# EasyEDA Pro project FrameworkGPU to MXM V3.3.epro, board PCB6
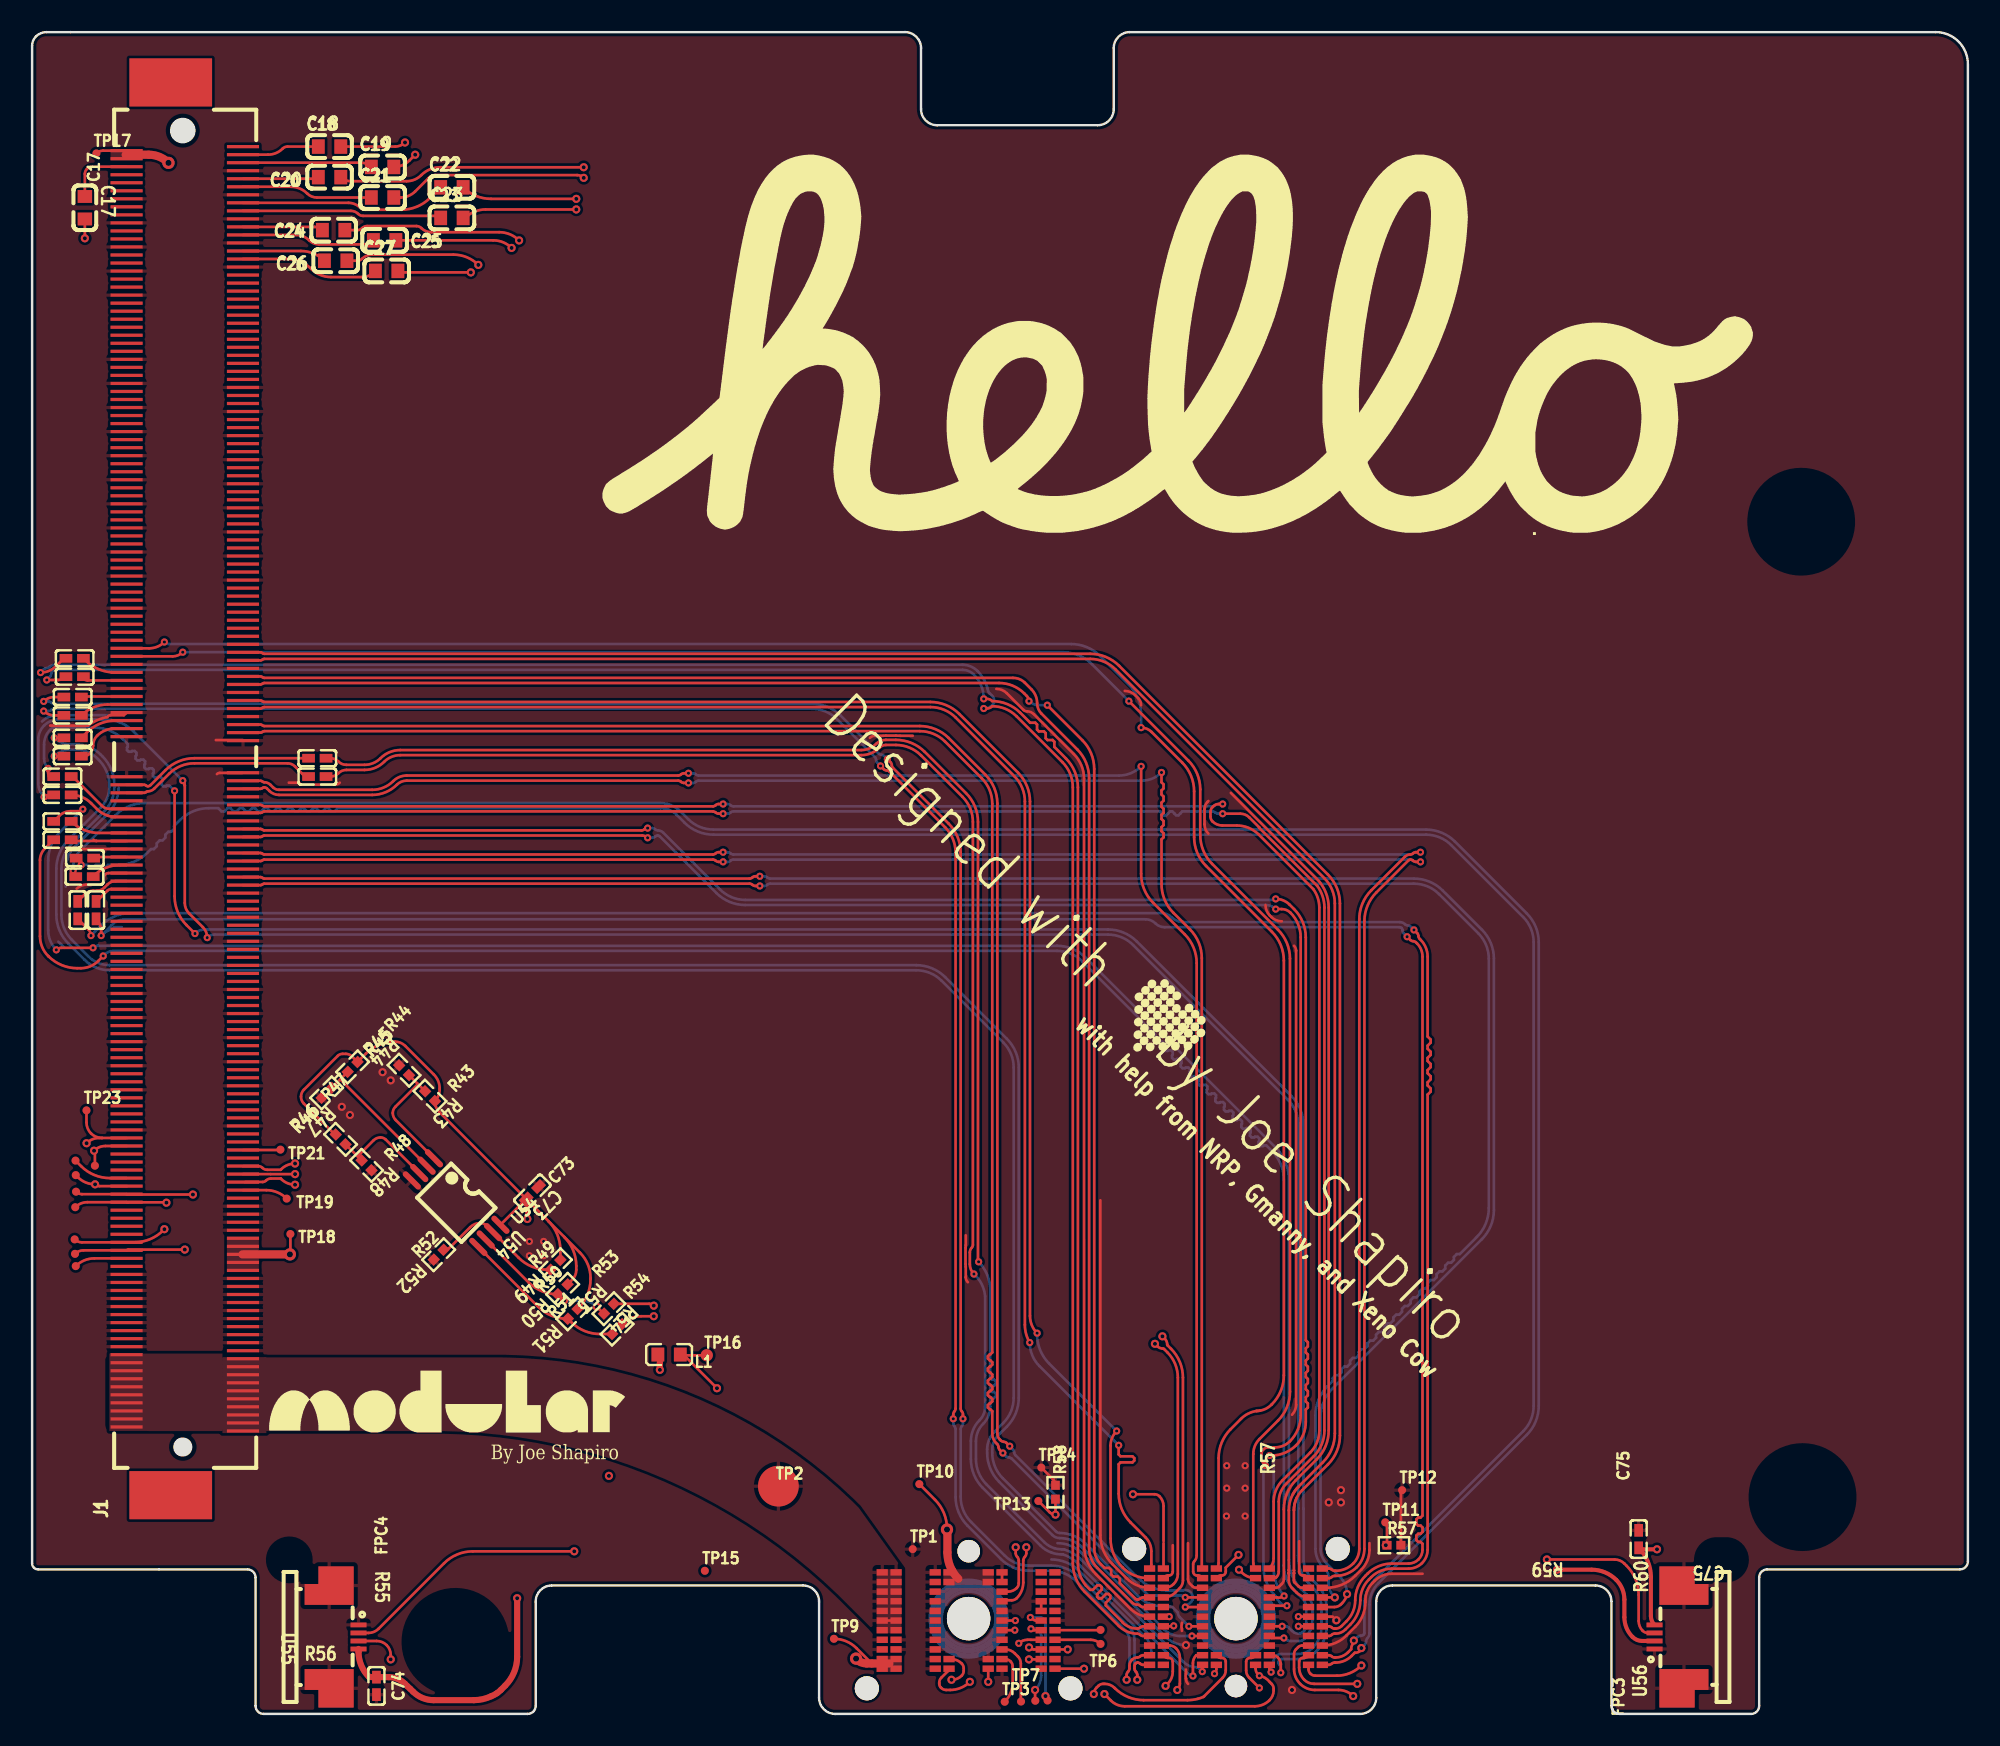
[diagram p7: board, top side]
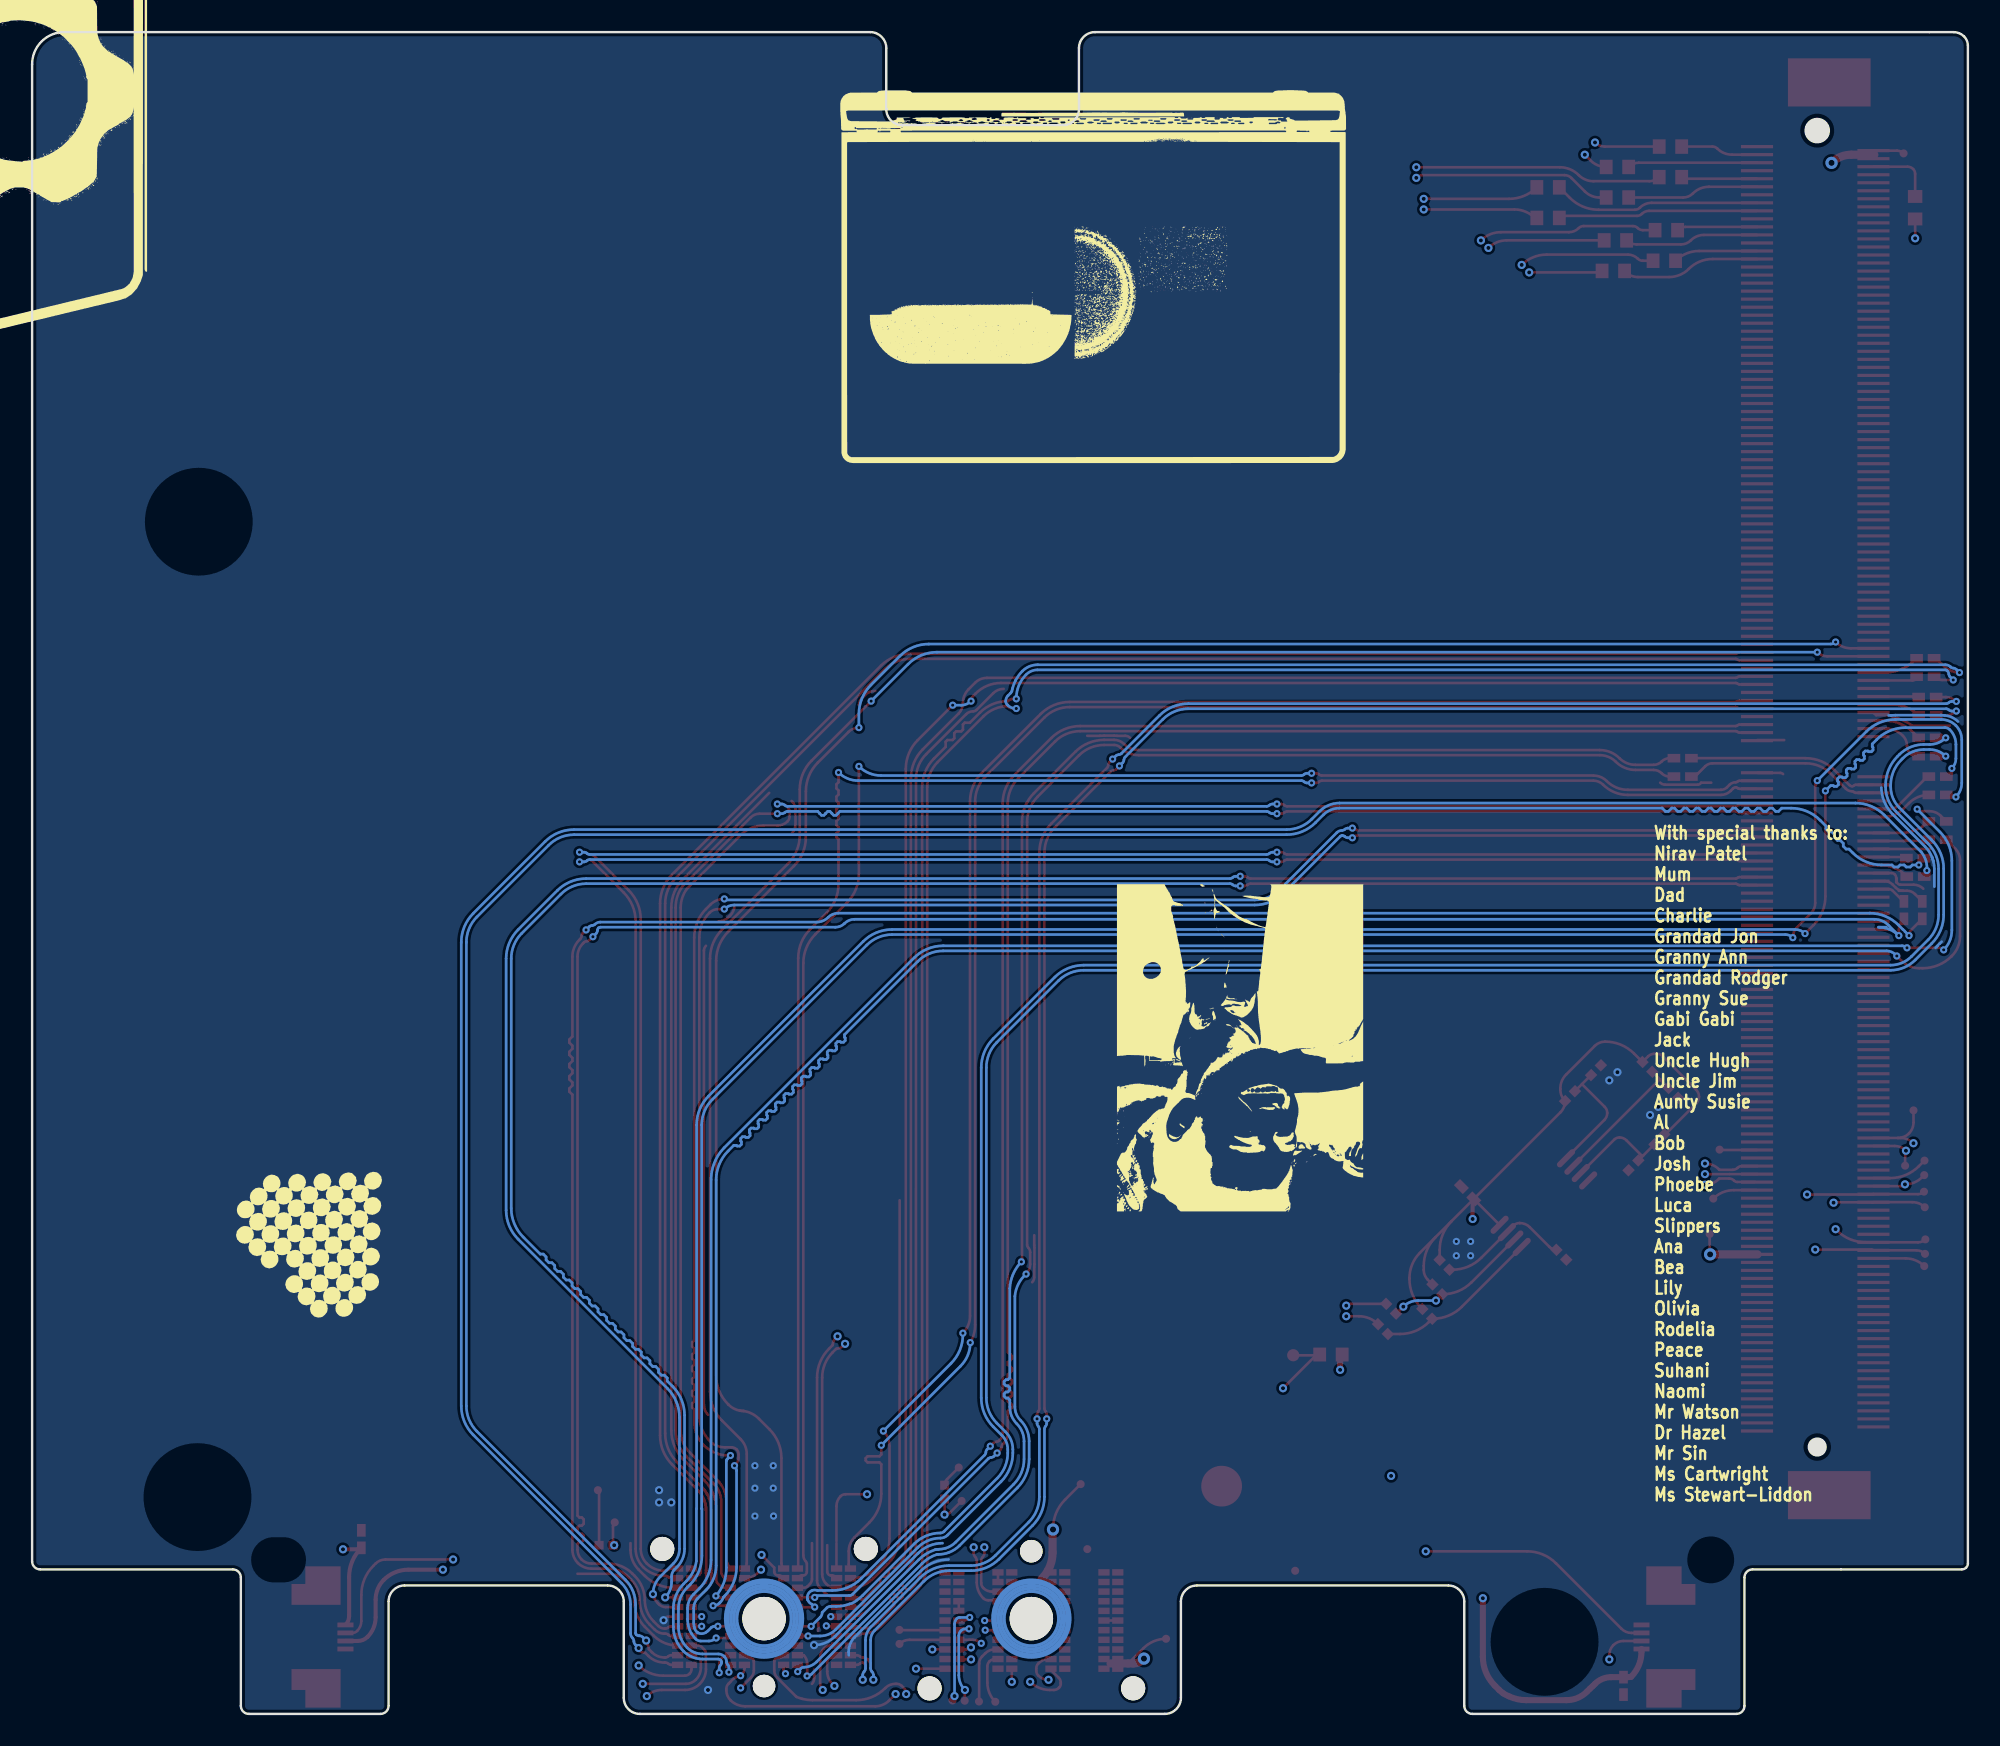
[diagram p8: board, bottom side, seen from below]

Outline 120.56 x 104.76 mm; copper layers: Top Layer, Inner1, Inner2, Inner3, Inner4, Bottom Layer. Coordinates in mm from the lower left corner of the outline.
Outline path: 0,103.91 arc(0.06,104.22) 0.24,104.49 arc(0.54,104.69) 0.89,104.76 54.37,104.76 arc(55.07,104.47) 55.37,103.76 55.37,99.96 arc(55.66,99.25) 56.37,98.96 66.37,98.96 arc(67.07,99.25) 67.37,99.96 67.37,103.76 arc(67.66,104.47) 68.37,104.76 118.56,104.76 arc(119.98,104.17) 120.56,102.76 120.56,9.5 arc(120.42,9.15) 120.06,9 108.06,9 arc(107.71,8.85) 107.56,8.5 107.56,0.5 arc(107.42,0.15) 107.06,0 98.87,0 arc(98.51,0.15) 98.37,0.5 98.37,7 arc(98.07,7.71) 97.37,8 84.72,8 arc(84.01,7.71) 83.72,7 83.72,1 arc(83.42,0.29) 82.72,0 50.02,0 arc(49.31,0.29) 49.02,1 49.02,7 arc(48.72,7.71) 48.02,8 32.37,8 arc(31.66,7.71) 31.37,7 31.37,0.5 arc(31.22,0.15) 30.87,0 14.42,0 arc(14.06,0.15) 13.92,0.5 13.92,8.5 arc(13.77,8.85) 13.42,9 0.38,9 arc(0.23,9.03) 0.11,9.11 arc(0.03,9.23) 0,9.38 0,103.91
Stack: Top Layer 0.035mm Outer layer thickness 1oz / Dielectric1 0.0994mm 3313 RC57% 4.2mil / Inner1 0.0152mm Inner layer thickness / Dielectric2 0.55mm 0.55mm H/H No copper / Inner2 0.0152mm Inner layer thickness / Dielectric3 0.1088mm 2116 RC54% 4.9mil / Inner3 0.0152mm Inner layer thickness / Dielectric4 0.55mm 0.55mm H/H No copper / Inner4 0.0152mm Inner layer thickness / Dielectric5 0.0994mm 3313 RC57% 4.2mil / Bottom Layer 0.035mm Outer layer thickness 1oz

## Design rules (mm)
net PCIE_RX_7N: PCIE_RX_7
net PCIE_RX_1P: PCIE_RX_1, PCIE_RX_1
net PCIE_RX_1N: PCIE_RX_1, PCIE_RX_1
net PCIE_RX_7P: PCIE_RX_7
net PCIE_RX_6N: DP1
net PCIE_RX_3N: PCIE_RX_3
net PCIE_RX_0N: PCIE_RX_0
net PCIE_RX_0P: PCIE_RX_0
net PCIE_RX_4N: PCIE_RX_4
net PCIE_RX_6P: DP1
net PCIE_RX_5N: PCIE_RX_5
net PCIE_RX_5P: PCIE_RX_5
net PCIE_RX_2P: PCIE_RX_2
net PCIE_RX_4P: PCIE_RX_4
net PCIE_RX_3P: PCIE_RX_3
net PCIE_RX_2N: PCIE_RX_2
net PEX_REFCLK-: DP11
net DP_A_AUXN: DP_A_AUX
net PEX_REFCLK+: DP11
net DP_A_AUXP: DP_A_AUX
net DP_A_L0N: DP_A_L0
net DP_A_L1N: DP_A_L1
net DP_A_L3N: DP_A_L3
net DP_A_L0P: DP_A_L0
net DP_A_L2N: DP_A_L2
net DP_A_L2P: DP_A_L2
net DP_A_L1P: DP_A_L1
net DP_A_L3P: DP_A_L3
net PCIE_TX_7P: DP2
net PCIE_TX_6P: PCIE_TX_6
net PCIE_TX_7N: DP2
net PCIE_TX_6N: PCIE_TX_6
net PCIE_TX_4P: PCIE_TX_4
net PCIE_TX_4N: PCIE_TX_4
net PCIE_TX_3P: PCIE_TX_3
net PCIE_TX_5N: PCIE_TX_5
net PCIE_TX_2N: PCIE_TX_2
net PCIE_TX_0P: PCIE_TX_0
net PCIE_TX_5P: PCIE_TX_5
net PCIE_TX_2P: PCIE_TX_2
net PCIE_TX_0N: PCIE_TX_0
net PCIE_TX_1N: PCIE_TX_1, PCIE_TX_1
net PCIE_TX_1P: PCIE_TX_1, PCIE_TX_1
net PCIE_TX_3N: PCIE_TX_3
net $1N28205: DP14
net $1N28137: DP14
net $1N28215: DP13
net $1N28141: DP13
net $1N28230: DP12
net $1N28147: DP12
template: Custom Config
spacing copperThickness1oz (default): track to track 0.102, other pairs 0.152 to 0.3
spacing copperThickness2oz: track to track 0.203, other pairs 0.152 to 0.3
track width copperThickness1oz (default): min 0.127, default 0.165, max 2.54
track width copperThickness2oz: min 0.203, default 0.254, max 2.54
differential pair differentialPair (default): width min 0.127, default 0.165, max 2.54; gap min 0.152, default 0.152
via viaSize (default): diameter min 0.251, default 0.45, max 10; hole min 0.15, default 0.2, max 6.299

## Placement (name value [footprint] x y rotation side)
C1  220nF  [C0402#2]  2.65 65.75 180 top
C2  220nF  [C0402#2]  2.65 64.61 180 top
C3  220nF  [C0402#2]  2.52 63.34 180 top
C4  220nF  [C0402#2]  2.52 62.2 180 top
C5  220nF  [C0402#2]  2.52 60.8 180 top
C6  220nF  [C0402#2]  2.52 59.66 180 top
C7  220nF  [C0402#2]  17.76 59.53 0 top
C8  220nF  [C0402#2]  17.76 58.39 0 top
C9  220nF  [C0402#2]  1.89 58.39 180 top
C10  220nF  [C0402#2]  1.89 57.24 180 top
C11  220nF  [C0402#2]  1.89 55.59 180 top
C12  220nF  [C0402#2]  1.89 54.45 180 top
C13  220nF  [C0402#2]  3.29 53.31 180 top
C14  220nF  [C0402#2]  3.26 52.16 180 top
C15  220nF  [C0402#2]  2.84 50.07 270 top
C16  220nF  [C0402#2]  3.98 50.07 270 top
C17  100nF  [C0603]  3.29 93.82 270 top
C18  100nF  [C0603]  18.53 97.63 0 top
C19  100nF  [C0603]  21.83 96.36 0 top
C20  100nF  [C0603]  18.53 95.72 0 top
C21  100nF  [C0603]  21.83 94.45 0 top
C22  100nF  [C0603]  26.15 95.09 0 top
C23  100nF  [C0603]  26.15 93.18 0 top
C24  100nF  [C0603]  18.78 92.42 0 top
C25  100nF  [C0603]  21.95 91.79 0 top
C26  100nF  [C0603]  18.91 90.52 0 top
C27  100nF  [C0603]  22.08 89.88 0 top
C73  0.1uF  [C0402]  31.16 32.46 225 top
C74  0.1uF  [C0402]  21.45 1.74 270 top
C75  0.1uF  [C0402]  100.06 10.89 90 top
FPC3  527460471  [FPC-SMD_4P-P0.50_MOLEX_0527460471]  101.96 4.79 90 top
FPC4  527460471  [FPC-SMD_4P-P0.50_MOLEX_0527460471]  19.41 4.79 270 top
J1  MXM3.0  [CONN-SMD_314P-P0.50_10151114-001TLF]  9.51 57.62 90 top
L1  100M  [L0603]  39.67 22.38 180 top
R43  0/NC  [R0402]  24.78 38.48 315 top
R44  0  [R0402]  23.16 40.1 315 top
R45  0/NC  [R0402]  19.96 40.3 45 top
R46  0  [R0402]  18.34 38.68 45 top
R47  0/NC  [R0402]  19.21 35.79 135 top
R48  0  [R0402]  20.83 34.17 135 top
R49  100K ±1%  [R0402]  32.59 27.97 45 top
R50  4.7K ±1%  [R0402]  33.04 26.45 45 top
R51  4.7K ±1%  [R0402]  33.67 24.92 45 top
R52  100K ±1%  [R0402]  25.32 28.6 45 top
R53  0  [R0402]  35.92 25.24 225 top
R54  0  [R0402]  36.43 23.97 225 top
R57  330k ±1%  [R0402]  84.82 10.51 180 top
R58  330k ±1%  [R0402]  63.74 13.81 270 top
TP1  -  [Test-Point-0.5mm]  54.85 10.26 0 top
TP2  -  [Test-Point-0.5mm#2]  46.48 14.19 0 top
TP3  -  [Test-Point-0.5mm]  60.58 0.76 0 top
TP4  -  [Test-Point-0.5mm]  61.59 0.77 0 top
TP5  -  [Test-Point-0.5mm]  66.55 5.23 0 top
TP6  -  [Test-Point-0.5mm]  66.55 4.36 0 top
TP7  -  [Test-Point-0.5mm]  63.24 0.84 0 top
TP8  -  [Test-Point-0.5mm]  62.48 0.82 0 top
TP9  -  [Test-Point-0.5mm]  49.94 4.68 0 top
TP10  -  [Test-Point-0.5mm]  55.26 14.31 0 top
TP11  -  [Test-Point-0.5mm]  84.28 11.93 0 top
TP12  -  [Test-Point-0.5mm]  85.33 13.94 0 top
TP13  -  [Test-Point-0.5mm]  62.67 13.26 0 top
TP14  -  [Test-Point-0.5mm]  62.85 15.35 0 top
TP15  -  [Test-Point-0.5mm]  41.9 8.91 0 top
TP16  -  [Test-Point-0.5mm#3]  42.02 22.34 0 top
TP17  -  [Test-Point-0.5mm]  4 97.2 0 top
TP18  -  [Test-Point-0.5mm]  16.09 29.89 0 top
TP19  -  [Test-Point-0.5mm]  15.86 32.1 0 top
TP20  -  [Test-Point-0.5mm]  2.72 27.89 0 top
TP21  -  [Test-Point-0.5mm]  15.47 35.15 0 top
TP22  -  [Test-Point-0.5mm]  3.91 34.15 0 top
TP23  -  [Test-Point-0.5mm]  3.39 37.59 0 top
TP24  -  [Test-Point-0.5mm]  2.74 32.53 0 top
TP25  -  [Test-Point-0.5mm]  2.72 33.56 0 top
TP26  -  [Test-Point-0.5mm]  2.7 34.47 0 top
TP27  -  [Test-Point-0.5mm]  2.69 31.56 0 top
TP28  -  [Test-Point-0.5mm]  2.67 28.66 0 top
TP29  -  [Test-Point-0.5mm]  2.65 29.56 0 top
U2  FXBeam  [FW_FXBEAM_FULL]  66.66 5.94 0 top
U54  BR24G32FVT-3GE2  [TSSOP-8_L4.4-W3.0-P0.65-LS6.4-BL]  26.41 31.85 225 top

## Footprints (pads in the part's own frame, mm; a bottom-side part is the same pattern mirrored in y, then rotated)
C0402
  rect 0.79x0.54 smd: 1(0.545,0) 2(-0.545,0)
C0402#2
  rect 0.79x0.54 smd: 1(-0.545,0) 2(0.545,0)
C0603
  rect 0.8x0.9 smd: 1(-0.7,0) 2(0.7,0)
CONN-SMD_314P-P0.50_10151114-001TLF
  rect 0.2x2 smd: 1(-30,-3.625) 2(-29.75,3.625) 3(-29.5,-3.625) 4(-29.25,3.625) 5(-29,-3.625) 6(-28.75,3.625) 7(-28.5,-3.625) 8(-28.25,3.625) 9(-28,-3.625) 10(-27.75,3.625) 11(-27.5,-3.625) 12(-27.25,3.625) 13(-27,-3.625) 14(-26.75,3.625) 15(-26.5,-3.625) 16(-26.25,3.625) 17(-26,-3.625) 18(-25.75,3.625) 19(-25.5,-3.625) 20(-25.25,3.625) 21(-25,-3.625) 22(-24.75,3.625) 23(-24.5,-3.625) 24(-24.25,3.625) 25(-24,-3.625) 26(-23.75,3.625) 27(-23.5,-3.625) 28(-23.25,3.625) 29(-23,-3.625) 30(-22.75,3.625) 31(-22.5,-3.625) 32(-22.25,3.625) 33(-22,-3.625) 34(-21.75,3.625) 35(-21.5,-3.625) 36(-21.25,3.625) 37(-21,-3.625) 38(-20.75,3.625) 39(-20.5,-3.625) 40(-20.25,3.625) 41(-20,-3.625) 42(-19.75,3.625) 43(-19.5,-3.625) 44(-19.25,3.625) 45(-19,-3.625) 46(-18.75,3.625) 47(-18.5,-3.625) 48(-18.25,3.625) 49(-18,-3.625) 50(-17.75,3.625) 51(-17.5,-3.625) 52(-17.25,3.625) 53(-17,-3.625) 54(-16.75,3.625) 55(-16.5,-3.625) 56(-16.25,3.625) 57(-16,-3.625) 58(-15.75,3.625) 59(-15.5,-3.625) 60(-15.25,3.625) 61(-15,-3.625) 62(-14.75,3.625) 63(-14.5,-3.625) 64(-14.25,3.625) 65(-14,-3.625) 66(-13.75,3.625) 67(-13.5,-3.625) 68(-13.25,3.625) 69(-13,-3.625) 70(-12.75,3.625) 71(-12.5,-3.625) 72(-12.25,3.625) 73(-12,-3.625) 74(-11.75,3.625) 75(-11.5,-3.625) 76(-11.25,3.625) 77(-11,-3.625) 78(-10.75,3.625) 79(-10.5,-3.625) 80(-10.25,3.625) 81(-10,-3.625) 82(-9.75,3.625) 83(-9.5,-3.625) 84(-9.25,3.625) 85(-9,-3.625) 86(-8.75,3.625) 87(-8.5,-3.625) 88(-8.25,3.625) 89(-8,-3.625) 90(-7.75,3.625) 91(-7.5,-3.625) 92(-7.25,3.625) 93(-7,-3.625) 94(-6.75,3.625) 95(-6.5,-3.625) 96(-6.25,3.625) 97(-6,-3.625) 98(-5.75,3.625) 99(-5.5,-3.625) 100(-5.25,3.625) 101(-5,-3.625) 102(-4.75,3.625) 103(-4.5,-3.625) 104(-4.25,3.625) 105(-4,-3.625) 106(-3.75,3.625) 107(-3.5,-3.625) 108(-3.25,3.625) 109(-3,-3.625) 110(-2.75,3.625) 111(-2.5,-3.625) 112(-2.25,3.625) 113(-2,-3.625) 114(-1.75,3.625) 115(-1.5,-3.625) 116(-1.25,3.625) 117(-1,-3.625) 118(-0.75,3.625) 119(-0.5,-3.625) 120(-0.25,3.625) 121(-0.001,-3.625) 122(0.25,3.625) 123(0.5,-3.625) 124(0.75,3.625) 125(1,-3.625) 133(3,-3.625) 134(3.249,3.625) 135(3.5,-3.625) 136(3.75,3.625) 137(4,-3.625) 138(4.25,3.625) 139(4.5,-3.625) 140(4.75,3.625) 141(5,-3.625) 142(5.25,3.625) 143(5.5,-3.625) 144(5.75,3.625) 145(6,-3.625) 146(6.25,3.625) 147(6.5,-3.625) 148(6.75,3.625) 149(7,-3.625) 150(7.25,3.625) 151(7.5,-3.625) 152(7.75,3.625) 153(8,-3.625) 154(8.25,3.625) 155(8.5,-3.625) 156(8.75,3.625) 157(9,-3.625) 158(9.25,3.625) 159(9.5,-3.625) 160(9.75,3.625) 161(10,-3.625) 162(10.25,3.625) 163(10.5,-3.625) 164(10.75,3.625) 165(11,-3.625) 166(11.25,3.625) 167(11.5,-3.625) 168(11.75,3.625) 169(12,-3.625) 170(12.25,3.625) 171(12.5,-3.625) 172(12.75,3.625) 173(13,-3.625) 174(13.25,3.625) 175(13.5,-3.625) 176(13.75,3.625) 177(14,-3.625) 178(14.25,3.625) 179(14.5,-3.625) 180(14.75,3.625) 181(15,-3.625) 182(15.25,3.625) 183(15.5,-3.625) 184(15.75,3.625) 185(16,-3.625) 186(16.25,3.625) 187(16.5,-3.625) 188(16.75,3.625) 189(17,-3.625) 190(17.25,3.625) 191(17.5,-3.625) 192(17.75,3.625) 193(18,-3.625) 194(18.25,3.625) 195(18.5,-3.625) 196(18.75,3.625) 197(19,-3.625) 198(19.25,3.625) 199(19.5,-3.625) 200(19.75,3.625) 201(20,-3.625) 202(20.25,3.625) 203(20.5,-3.625) 204(20.75,3.625) 205(21,-3.625) 206(21.25,3.625) 207(21.5,-3.625) 208(21.75,3.625) 209(22,-3.625) 210(22.25,3.625) 211(22.5,-3.625) 212(22.75,3.625) 213(23,-3.625) 214(23.25,3.625) 215(23.5,-3.625) 216(23.75,3.625) 217(24,-3.625) 218(24.25,3.625) 219(24.5,-3.625) 220(24.75,3.625) 221(25,-3.625) 222(25.25,3.625) 223(25.5,-3.625) 224(25.75,3.625) 225(26,-3.625) 226(26.25,3.625) 227(26.5,-3.625) 228(26.75,3.625) 229(27,-3.625) 230(27.25,3.625) 231(27.5,-3.625) 232(27.75,3.625) 233(28,-3.625) 234(28.25,3.625) 235(28.5,-3.625) 236(28.75,3.625) 237(29,-3.625) 238(29.25,3.625) 239(29.5,-3.625) 240(29.75,3.625) 241(30,-3.625) 242(30.25,3.625) 243(30.5,-3.625) 244(30.75,3.625) 245(31,-3.625) 246(31.25,3.625) 247(31.5,-3.625) 248(31.75,3.625) 249(32,-3.625) 250(32.25,3.625) 251(32.5,-3.625) 252(32.75,3.625) 253(33,-3.625) 254(33.25,3.625) 255(33.5,-3.625) 256(33.75,3.625) 257(34,-3.625) 258(34.25,3.625) 259(34.5,-3.625) 260(34.75,3.625) 261(35,-3.625) 262(35.25,3.625) 263(35.5,-3.625) 264(35.75,3.625) 265(36,-3.625) 266(36.25,3.625) 267(36.5,-3.625) 268(36.75,3.625) 269(37,-3.625) 270(37.25,3.625) 271(37.5,-3.625) 272(37.75,3.625) 273(38,-3.625) 274(38.25,3.625) 275(38.5,-3.625) 276(38.75,3.625) 277(39,-3.625) 278(39.25,3.625) 279(39.5,-3.625) 280(39.75,3.625) 281(40,-3.625) E1(-40,-3.625) E1(-39.5,-3.625) E1(-39,-3.625) E1(-38.5,-3.625) E1(-38,-3.625) E1(-37.5,-3.625) E1(-37,-3.625) E1(-36.5,-3.625) E1(-36,-3.625) E1(-35.5,-3.625) E2(-39.75,3.625) E2(-39.25,3.625) E2(-38.75,3.625) E2(-38.25,3.625) E2(-37.75,3.625) E2(-37.25,3.625) E2(-36.75,3.625) E2(-36.25,3.625) E2(-35.75,3.625) E2(-35.25,3.625) E3(-35,-3.625) E3(-34.5,-3.625) E3(-34,-3.625) E3(-33.5,-3.625) E3(-33,-3.625) E3(-32.5,-3.625) E3(-32,-3.625) E3(-31.5,-3.625) E3(-31,-3.625) E3(-30.5,-3.625) E4(-34.75,3.625) E4(-34.25,3.625) E4(-33.75,3.625) E4(-33.25,3.625) E4(-32.75,3.625) E4(-32.25,3.625) E4(-31.75,3.625) E4(-31.25,3.625) E4(-30.75,3.625) E4(-30.25,3.625)
  rect 3x5.15 smd: 282(44,0.875) 283(-44,0.875)
FPC-SMD_4P-P0.50_MOLEX_0527460471
  rect 0.3x1 smd: 1(-0.75,0.915) 2(-0.25,0.915) 3(0.25,0.915) 4(0.75,0.915)
  custom 2.4x3.06 smd: 5(3.2,-0.915) 6(-3.2,-0.915)
FW_FXBEAM_FULL
  round 1.5 hole 1.5: (-14.67,-4.34) (-1.99,-4.345) (1.98,4.34) (14.66,4.34)
  round 2.7 hole 2.7: (-8.33,0) (8.32,0)
  round 1.4 hole 1.4: (-8.325,4.2) (8.32,-4.2)
  rect 0.7x0.4 smd: PA1(-2.95,2.88) PA2(-3.81,2.88) PA3(-6.25,2.88) PA4(-7.11,2.88) PA5(-9.55,2.88) PA6(-10.41,2.88) PA7(-12.85,2.88) PA8(-13.71,2.88) PB1(-2.95,2.28) PB2(-3.81,2.28) PB3(-6.25,2.28) PB4(-7.11,2.28) PB5(-9.55,2.28) PB6(-10.41,2.28) PB7(-12.85,2.28) PB8(-13.71,2.28) PC1(-2.95,1.68) PC2(-3.81,1.68) PC3(-6.25,1.68) PC6(-10.41,1.68) PC7(-12.85,1.68) PC8(-13.71,1.68) PD1(-2.95,1.08) PD2(-3.81,1.08) PD3(-6.25,1.08) PD6(-10.41,1.08) PD7(-12.85,1.08) PD8(-13.71,1.08) PE1(-2.95,0.48) PE2(-3.81,0.48) PE3(-6.25,0.48) PE6(-10.41,0.48) PE7(-12.85,0.48) PE8(-13.71,0.48) PF1(-2.95,-0.12) PF2(-3.81,-0.12) PF3(-6.25,-0.12) PF6(-10.41,-0.12) PF7(-12.85,-0.12) PF8(-13.71,-0.12) PG1(-2.95,-0.72) PG2(-3.81,-0.72) PG3(-6.25,-0.72) PG6(-10.41,-0.72) PG7(-12.85,-0.72) PG8(-13.71,-0.72) PH1(-2.95,-1.32) PH2(-3.81,-1.32) PH3(-6.25,-1.32) PH6(-10.41,-1.32) PH7(-12.85,-1.32) PH8(-13.71,-1.32) PJ1(-2.95,-1.92) PJ2(-3.81,-1.92) PJ3(-6.25,-1.92) PJ6(-10.41,-1.92) PJ7(-12.85,-1.92) PJ8(-13.71,-1.92) PK1(-2.95,-2.52) PK2(-3.81,-2.52) PK3(-6.25,-2.52) PK4(-7.11,-2.52) PK5(-9.55,-2.52) PK6(-10.41,-2.52) PK7(-12.85,-2.52) PK8(-13.71,-2.52) PL1(-2.95,-3.12) PL2(-3.81,-3.12) PL3(-6.25,-3.12) PL4(-7.11,-3.12) PL5(-9.55,-3.12) PL6(-10.41,-3.12) PL7(-12.85,-3.12) PL8(-13.71,-3.12) SA1(13.7,3.12) SA2(12.84,3.12) SA3(10.4,3.12) SA4(9.54,3.12) SA5(7.1,3.12) SA6(6.24,3.12) SA7(3.8,3.12) SA8(2.94,3.12) SB1(13.7,2.52) SB2(12.84,2.52) SB3(10.4,2.52) SB4(9.54,2.52) SB5(7.1,2.52) SB6(6.24,2.52) SB7(3.8,2.52) SB8(2.94,2.52) SC1(13.7,1.92) SC2(12.84,1.92) SC3(10.4,1.92) SC6(6.24,1.92) SC7(3.8,1.92) SC8(2.94,1.92) SD1(13.7,1.32) SD2(12.84,1.32) SD3(10.4,1.32) SD6(6.24,1.32) SD7(3.8,1.32) SD8(2.94,1.32) SE1(13.7,0.72) SE2(12.84,0.72) SE3(10.4,0.72) SE6(6.24,0.72) SE7(3.8,0.72) SE8(2.94,0.72) SF1(13.7,0.12) SF2(12.84,0.12) SF3(10.4,0.12) SF6(6.24,0.12) SF7(3.8,0.12) SF8(2.94,0.12) SG1(13.7,-0.48) SG2(12.84,-0.48) SG3(10.4,-0.48) SG6(6.24,-0.48) SG7(3.8,-0.48) SG8(2.94,-0.48) SH1(13.7,-1.08) SH2(12.84,-1.08) SH3(10.4,-1.08) SH6(6.24,-1.08) SH7(3.8,-1.08) SH8(2.94,-1.08) SJ1(13.7,-1.68) SJ2(12.84,-1.68) SJ3(10.4,-1.68) SJ6(6.24,-1.68) SJ7(3.8,-1.68) SJ8(2.94,-1.68) SK1(13.7,-2.28) SK2(12.84,-2.28) SK3(10.4,-2.28) SK4(9.54,-2.28) SK5(7.1,-2.28) SK6(6.24,-2.28) SK7(3.8,-2.28) SK8(2.94,-2.28) SL1(13.7,-2.88) SL2(12.84,-2.88) SL3(10.4,-2.88) SL4(9.54,-2.88) SL5(7.1,-2.88) SL6(6.24,-2.88) SL7(3.8,-2.88) SL8(2.94,-2.88)
L0603
  rect 0.8x0.864 smd: 1(-0.7,0) 2(0.7,0)
R0402
  rect 0.566x0.54 smd: 1(-0.433,0) 2(0.433,0)
Test-Point-0.5mm
  round 0.5 smd: 1(0,0)
Test-Point-0.5mm#2
  round 2.54 smd: 1(0,0)
Test-Point-0.5mm#3
  round 0.762 smd: 1(0,0)
TSSOP-8_L4.4-W3.0-P0.65-LS6.4-BL
  oval 0.353x1.454 smd: 1(-0.975,-2.927) 2(-0.325,-2.927) 3(0.325,-2.927) 4(0.975,-2.927) 5(0.975,2.927) 6(0.325,2.927) 7(-0.325,2.927) 8(-0.975,2.927)

## Nets
As in the schematic.

Pads without a net: J1 2 10 12 14 16 19 26 28 29 30 33 35 38 39 40 41 42 43 44 45 48 49 50 51 54 55 56 57 60 61 62 63 66 67 68 69 72 73 74 75 78 79 80 81 84 85 86 87 90 91 92 93 158 159 160 161 162 163 164 165 167 168 169 170 171 172 175 176 177 178 181 182 183 184 187 188 189 190 193 194 195 196 199 200 201 202 205 206 207 208 211 212 213 214 217 218 219 220 223 224 225 226 227 229 230 231 232 233 234 235 236 237 238 239 240 241 242 243 245 246 247 248 249 252 254 258 260 264 266 270 272 274 281 282 283; TP15 1; U2 PA1 PA2 PB1 PB2 PC1 PC2 PK1 PL2 SA2 SL7

## Via types
v1: diameter 0.508, hole 0.254, Top Layer to Bottom Layer, 76 vias
v2: diameter 0.45, hole 0.2, Top Layer to Bottom Layer, 96 vias
v3: diameter 0.762, hole 0.381, Top Layer to Bottom Layer, 4 vias

## Routing (per net, layer and track width the routed paths; a pad name or vN(x,y) marks a point on that pad's centre or on a via; arc(x,y) is an arc through that point)
12V_FAN: length 108.1
  Top Layer w0.165: C75.2 100.08,10.33
  Top Layer w0.254: v1(101.2,10.25) 100.28,10.25 arc(100.16,10.28) C75.2 ; 100.08,10.33 arc(100.63,9.5) 100.82,8.53 100.82,6.09 arc(100.88,5.79) 101.05,5.54
  Top Layer w0.381: v1(30.21,7.21) 30.21,3.56 arc(30.02,2.59) 29.47,1.76 29.19,1.49 arc(29.07,1.38) 28.95,1.29 arc(28.77,1.18) 28.59,1.1 arc(28.06,0.92) 27.51,0.86 25,0.86 arc(24.31,0.99) 23.73,1.38 23.54,1.57 arc(23.45,1.65) 23.37,1.73 23.22,1.87 arc(22.76,2.18) 22.22,2.29 C74.2 ; v1(39.1,21.43) 39.1,22.08 arc(39.07,22.24) L1.2 ; FPC4.4 20.33,3.87 arc(20.5,3.03) 20.98,2.31 arc(21.12,2.29) 21.26,2.29
  Inner2 w0.381: v1(30.21,7.21) 30.21,8.06 arc(30.4,9.03) 30.95,9.85 v1(35.92,14.83)
  Inner3 w0.381: v1(35.92,14.83) 35.92,17.2 arc(36.12,18.17) 36.67,19 v1(39.1,21.43) 88.97,21.43 arc(89.95,21.24) 90.77,20.69 v1(101.2,10.25)
+3.3V: length 180.1
  Top Layer w0.165: U54.8 30.77,32.07 arc(30.77,32.07) C73.1 ; R49.2 32.9,28.9 arc(32.71,29.87) 32.16,30.69 ; J1.280 4.42,97.37 arc(4.19,97.33) TP17.1 ; TP10.1 56.24,13.33 arc(56.79,12.51) 56.98,11.54 ; 33.98,25.23 34.04,25.29 arc(34.59,26.11) 34.78,27.08 34.78,27.14 arc(34.61,28) 34.13,28.72 33.15,29.7 ; C73.1 25.38,37.47 arc(25.16,37.79) R43.2 arc(25.31,38.5) 25.38,38.89 25.38,38.96 arc(25.29,39.42) 25.02,39.82 23.24,41.61 arc(22.94,41.81) 22.59,41.88 arc(21.62,41.68) 20.79,41.13 R45.2 19.91,40.96 arc(19.74,41.07) 19.54,41.11 19.34,41.11 arc(19.17,41.08) 19.03,40.99 16.93,38.88 arc(16.79,38.68) 16.75,38.45 arc(16.79,38.21) 16.93,38.01 18.81,36.13 arc(18.85,36.1) 18.91,36.09 ; C73.1 32.16,30.69 ; C73.1 arc(30.83,32) 30.84,31.9 ; 32.16,30.69 33.15,29.7 ; 33.15,29.7 arc(33.7,28.88) 33.89,27.91 33.89,27.65 arc(33.83,27.32) 33.64,27.05 R50.2
  Top Layer w0.254: v1(30.84,30.83) 30.84,31.9
  Top Layer w0.508: 5.83,97.12 7.27,97.12 arc(7.93,96.99) v3(8.49,96.61) ; 57.01,11.49 57.01,10.06 arc(57.08,9.47) 57.3,8.92 arc(57.48,8.66) 57.69,8.41
  Inner3 w0.508: 22.99,25.6 24.57,25.6 arc(25.54,25.8) 26.36,26.35 v1(30.84,30.83) ; 22.99,25.6 18.76,29.83 arc(18.21,30.65) 18.02,31.63 18.02,60 arc(17.82,60.97) 17.27,61.8 9.24,69.83 arc(8.69,70.66) 8.49,71.63 v3(8.49,96.61) ; 22.99,25.6 34.55,14.05 arc(35.37,13.49) 36.34,13.3 54.14,13.3 arc(55.12,13.11) 55.94,12.56 57.01,11.49
  vias: v3(56.98,11.49)
+5V: length 60.8
  Top Layer w0.165: TP18.1 16.09,28.7 arc(16.08,28.66) v3(16.06,28.62) ; 52.3,3.14 51.34,4.1 arc(50.7,4.53) TP9.1
  Top Layer w0.508: v3(16.06,28.62) 13.1,28.62 ; 53.39,3.14 51.98,3.14 arc(51.62,3.21) 51.32,3.42
  Inner2 w0.508: v3(51.32,3.44) 51.32,7.82 arc(51.12,8.79) 50.57,9.61 41.39,18.79 arc(40.57,19.34) 39.6,19.54 20.91,19.54 arc(19.94,19.73) 19.12,20.28 16.8,22.6 arc(16.25,23.42) 16.06,24.39 v3(16.06,28.62)
  Bottom Layer w0.165: 51.32,3.42 v3(51.32,3.44)
GND: length 262.9
  Top Layer w0.165: J1.106 2.27,53.87 ; 71.87,2.76 71.87,2.52 arc(71.84,2.36) 71.87,2.21 71.87,2.18 arc(71.9,2.01) 71.99,1.87 ; 4.45,51.8 4.46,51.81 4.46,52.06 ; 58.15,29.81 58.15,29.19 arc(58.14,29.12) 58.14,29.04 58.14,28.01 arc(58.14,27.93) 58.15,27.84 58.15,27.2 arc(58.18,27.03) 58.28,26.89 ; TP14.1 63.58,14.62 arc(63.7,14.44) R58.1 ; 71.99,10.63 71.99,8.4 arc(72.03,8.24) 72.12,8.09 72.26,7.96 arc(72.37,7.88) 72.5,7.86 U2.SC6 ; 78.91,10.76 78.91,8.86 arc(78.98,8.69) 79.15,8.62 79.24,8.62 arc(79.33,8.6) 79.4,8.56 U2.SB2 ; 73.26,56.86 73.21,56.81 arc(73.07,56.6) 73.02,56.35 73.02,55.41 arc(73.08,55.1) 73.26,54.83 ; 13.12,60.66 11.44,60.66 ; 15.99,58.01 16.62,58.01 arc(16.7,57.91) 16.82,57.88 18.86,57.88 arc(19.02,57.91) 19.16,58.01 ; 86.6,8.73 84.69,8.73 arc(84.11,8.61) 83.61,8.28 83.49,8.16 arc(83.16,7.67) 83.04,7.08 83.04,6.96 arc(82.88,6.13) 82.41,5.43 81.85,4.88 arc(81.17,4.42) U2.SJ1 ; 71.61,5.68 71.61,5.61 arc(71.59,5.46) 71.61,5.3 71.61,5.17 ; 83.3,10.63 83.3,10.21 arc(83.16,9.55) 82.79,8.98 82.4,8.6 arc(81.58,8.05) 80.61,7.86 U2.SC1 ; U2.PB3 U2.PA3 ; R57.1 85.25,13.75 arc(85.27,13.85) TP12.1 ; J1.140 5.81,62.31 arc(5.76,62.26) 5.71,62.21 4.88,62.21 arc(4.77,62.18) 4.68,62.09 arc(4.05,61.9) 3.49,61.56 1.13,61.56 ; U2.PE2 U2.PD2 ; U2.SF1 81.01,6.06 ; 4.46,52.06 arc(4.49,52.19) 4.56,52.29 arc(4.65,52.35) 4.76,52.37 J1.100 ; 4.46,52.06 arc(4.44,52.04) 4.44,52.01 4.44,51.89 arc(4.37,51.72) 4.2,51.65 3.38,51.65 arc(3.05,51.59) 2.78,51.4 ; 74.66,57.37 80.01,52.02 arc(80.56,51.19) 80.76,50.22 80.76,17.66 arc(80.56,16.68) 80.01,15.86 78.71,14.55 arc(78.15,13.73) 77.96,12.76 77.96,8.4 arc(77.93,8.24) 77.83,8.09 77.7,7.96 arc(77.58,7.88) 77.45,7.86 U2.SC3 ; 71.04,10.51 71.04,8.86 arc(70.97,8.69) 70.81,8.62 70.72,8.62 arc(70.63,8.6) 70.56,8.56 U2.SB7 ; 13.09,58.62 11.69,58.62 arc(11.59,58.6) 11.51,58.54 ; 66.53,31.99 66.54,11.13 arc(66.73,10.16) 67.28,9.33 68.16,8.45 arc(68.82,8.01) U2.SC8 ; 54.85,60.93 54.06,60.93 arc(53.93,60.94) 53.8,60.94 53.17,60.94 arc(53.09,60.94) 53.01,60.93 52.49,60.93 arc(52.32,60.89) 52.18,60.8 ; 60.05,63.85 arc(60.41,63.78) 60.71,63.58 61.74,62.54 arc(61.84,62.47) 61.96,62.45 arc(62.19,62.4) 62.39,62.27 64.88,59.78 arc(65.35,59.08) 65.52,58.25 65.52,10.49 arc(65.71,9.52) 66.26,8.7 68.42,6.55 arc(68.96,6.18) U2.SF8 ; 76.82,50.39 arc(76.89,50.03) 77.09,49.73 77.18,49.64 arc(77.48,49.44) 77.83,49.37 ; 69.07,62.83 arc(69.02,63.07) 68.89,63.27 68.71,63.45 arc(68.41,63.65) 68.06,63.72 ; 78.6,47.85 arc(78.69,47.7) 78.72,47.54 78.72,19.25 arc(78.66,18.92) 78.47,18.64
  Inner2 w0.165: 78.09,49.12 78.22,49.12
  Bottom Layer w0.165: 4.94,62.2 4.79,62.2 arc(4.65,62.21) 4.52,62.21 1.67,62.21 arc(1.55,62.2) 1.44,62.19 arc(0.99,62.08) 0.62,61.82 ; 2.02,47.72 1.9,47.84 arc(1.83,47.92) 1.75,47.98 1.63,48.1 ; 69.71,3.65 69.71,3.87 arc(69.61,4.37) 69.33,4.79 65.22,8.9 arc(64.42,9.43) 63.48,9.62 ; 2.09,51.53 2.09,52.64 arc(2.11,52.88) 2.15,53.11 ; 63.86,10.63 arc(64.69,10.47) 65.38,10.01 70.56,4.82 arc(71.16,4.42) v1(71.87,4.28) ; 2.23,53.36 arc(2.19,53.24) 2.15,53.11 ; 2.23,53.36 arc(2.19,53.24) 2.15,53.11 ; 2.23,53.36 arc(2.41,53.71) 2.66,54.02 4.68,56.04 arc(5.2,56.8) 5.39,57.7
  vias: v1(19.29,37.81) v1(19.8,37.3) v1(21.83,39.97) v1(22.34,39.46) v1(78.47,1.49) v1(80.76,13.17) v1(81.23,5.84) v1(81.52,13.94) v1(81.52,13.17) v2(30.97,29.43) v2(30.97,28.54) v2(31.86,29.43) v2(31.86,28.54) v2(74.41,15.46) v2(74.41,14.06) v2(74.39,12.32) v2(75.55,15.46) v2(75.55,14.06) v2(75.55,12.32)
VCC: length 0.9
  Top Layer w0.165: U2.PF8 U2.PF7
BK_ADDR0: length 7.7
  Top Layer w0.165: 24.03,39.23 R43.1 ; 24.03,39.23 22.62,37.82 arc(22.5,37.64) 22.46,37.43 arc(22.51,37.19) 22.64,36.99 U54.1 ; 24.03,39.23 R44.2
BK_ADDR1: length 9
  Top Layer w0.165: 24.57,34.15 19.21,39.5 arc(19.2,39.52) 19.2,39.54 ; 19.2,39.54 R45.1 ; 19.2,39.54 18.65,38.99
BK_ADDR2: length 6.6
  Top Layer w0.165: R47.1 20.24,34.76 ; 20.24,34.76 20.52,34.48 ; 20.24,34.76 arc(20.3,34.77) 20.35,34.81 21.27,35.73 arc(21.47,35.86) 21.7,35.91 arc(21.88,35.87) 22.03,35.77 U54.3
BK_I2C_SCL: length 37.6
  Top Layer w0.165: 36.23,25.55 38.44,25.55 arc(38.59,25.52) v1(38.72,25.43) ; U2.PC3 60.78,7.62 arc(61.08,7.67) 61.32,7.84 arc(61.42,7.98) 61.45,8.15 61.45,9.55 arc(61.43,9.67) 61.36,9.78 arc(61.29,9.88) 61.26,10.01 v1(61.26,10.38)
  Inner2 w0.165: v1(61.26,10.38) 61.26,10.08 arc(61.3,9.89) 61.41,9.73 arc(61.44,9.68) 61.45,9.62 arc(61.43,9.5) 61.36,9.4 61.2,9.24 arc(61.06,9.14) 60.89,9.11 60.69,9.11 arc(60.45,9.16) 60.26,9.29 60.18,9.36 arc(59.99,9.65) 59.93,9.98 59.93,10.73 arc(59.73,11.7) 59.18,12.52 47.21,24.5 arc(46.39,25.05) 45.41,25.24 39.55,25.24 arc(39.43,25.26) 39.32,25.33 arc(39.22,25.4) 39.09,25.43 v1(38.72,25.43)
BK_I2C_SDA: length 38.3
  Top Layer w0.165: v1(38.72,24.77) 37.93,24.77 arc(37.29,24.64) 36.74,24.28 ; v1(61.92,10.38) 61.92,10.01 arc(61.9,9.88) 61.83,9.78 arc(61.76,9.67) 61.73,9.55 61.73,8.19 arc(61.63,7.66) 61.32,7.21 arc(61.18,7.11) 61.02,7.08 60.56,7.08 arc(60.48,7.06) U2.PD3
  Inner2 w0.165: v1(38.72,24.77) 39.09,24.77 arc(39.22,24.79) 39.32,24.87 arc(39.43,24.94) 39.55,24.96 45.3,24.96 arc(46.27,24.77) 47.09,24.22 58.9,12.41 arc(59.45,11.58) 59.65,10.61 59.65,9.98 arc(59.74,9.54) 59.98,9.17 60.06,9.09 arc(60.35,8.9) 60.69,8.83 60.89,8.83 arc(61.16,8.89) 61.4,9.04 61.56,9.2 arc(61.69,9.39) 61.73,9.62 arc(61.74,9.68) 61.78,9.73 arc(61.88,9.89) 61.92,10.08 v1(61.92,10.38)
DP_A_AUXN: length 128.3
  Top Layer w0.165: J1.277 20.49,96.62 arc(20.83,96.56) C19.1 ; 70.85,4.26 70.85,4.26 arc(70.86,4.26) 70.87,4.25 ; 70.85,4.26 U2.SJ7 ; 70.85,4.26 arc(70.86,4.26) 70.87,4.25 ; v1(23.86,97.12) 23.5,96.76 arc(23.05,96.46) C19.2 ; v1(71.33,1.49) arc(71.44,1.67) 71.48,1.88 71.48,3.51 arc(71.42,3.82) 71.24,4.09 arc(71.07,4.21) 70.87,4.25
  Inner2 w0.165: v1(23.86,97.12) 23.86,91.57 arc(24.05,90.6) 24.6,89.77 26.42,87.96 arc(26.97,87.14) 27.16,86.16 27.16,81.66 arc(27.35,80.69) 27.91,79.87 64.77,43 arc(65.32,42.18) 65.52,41.21 65.52,23.12 arc(65.71,22.14) 66.26,21.32 67.14,20.44 arc(67.73,20.05) 68.44,19.91 arc(68.91,19.81) 69.3,19.55 69.45,19.4 arc(69.73,18.98) 69.83,18.48 69.83,11.37 arc(69.9,11.04) 70.09,10.76 arc(70.28,10.48) 70.34,10.15 70.34,4.32 arc(70.44,3.82) 70.72,3.4 arc(71,2.97) 71.1,2.48 71.1,2.03 arc(71.16,1.74) v1(71.33,1.49)
DP_A_AUXP: length 128.1
  Top Layer w0.165: v1(70.6,1.74) 70.72,1.87 arc(70.96,2.23) 71.04,2.65 71.04,3.26 arc(70.97,3.42) 70.81,3.49 70.72,3.49 arc(70.63,3.51) 70.56,3.56 U2.SK7 ; C18.2 22.61,97.63 arc(22.94,97.7) v1(23.22,97.88) ; C18.1 15.91,97.63 arc(15.75,97.6) 15.6,97.5 arc(15.19,97.22) 14.69,97.12 J1.279
  Inner2 w0.165: v1(23.22,97.88) 23.22,96.41 arc(23.26,96.25) 23.35,96.11 arc(23.49,95.89) 23.54,95.65 23.54,95.19 arc(23.49,95.06) 23.35,95 23.27,95 arc(23.08,94.81) 23.27,94.62 23.35,94.62 arc(23.54,94.43) 23.35,94.24 23.27,94.24 arc(23.08,94.05) 23.27,93.86 23.35,93.86 arc(23.49,93.8) 23.54,93.67 23.54,91.57 arc(23.76,90.48) 24.38,89.55 26.19,87.73 arc(26.6,87.18) 26.81,86.52 26.81,81.5 arc(27.01,80.53) 27.56,79.71 64.39,42.87 arc(64.94,42.05) 65.13,41.08 65.13,22.99 arc(65.33,22.02) 65.88,21.19 67.01,20.06 arc(67.61,19.66) 68.31,19.52 arc(68.78,19.43) 69.18,19.17 69.2,19.14 arc(69.43,18.79) 69.52,18.38 69.52,11.37 arc(69.61,10.92) 69.86,10.54 arc(69.98,10.36) 70.02,10.15 70.02,3.12 arc(70.17,2.38) v1(70.6,1.74)
DP_A_HPD: length 4.3
  Top Layer w0.165: C17.1 3.29,95.93 arc(3.32,96.09) 3.41,96.23 arc(3.57,96.34) 3.76,96.37 J1.276
DP_A_L0N: length 117.4
  Top Layer w0.165: v2(70.82,6.06) 70.46,6.06 U2.SF7 ; C27.1 21.31,89.81 arc(20.97,89.58) 20.56,89.5 18.61,89.5 arc(17.95,89.63) 17.38,90.01 arc(16.7,90.46) 15.9,90.62 J1.253 ; v1(27.32,89.79) 23,89.79 arc(22.88,89.81) C27.2
  Inner2 w0.165: 70.34,20.66 70.24,20.76 arc(70.23,20.77) 70.23,20.79 arc(70.23,20.81) 70.22,20.82 70.18,20.85 arc(69.61,21.23) 68.94,21.37 68.9,21.37 arc(68.12,21.52) 67.45,21.97 arc(67.01,22.63) 66.85,23.42 66.85,42.48 arc(66.68,43.33) 66.2,44.05 29.62,80.62 arc(29.07,81.45) 28.88,82.42 28.88,86.49 arc(28.82,86.62) 28.69,86.68 28.23,86.68 arc(28.04,86.87) 28.23,87.06 28.69,87.06 arc(28.82,87.12) 28.88,87.25 28.88,87.56 arc(28.71,88.41) 28.23,89.13 27.95,89.41 arc(27.85,89.47) 27.74,89.49 arc(27.63,89.52) 27.53,89.58 v1(27.32,89.79) ; 70.34,20.66 arc(70.29,20.72) 70.23,20.78 ; 70.34,20.66 arc(70.81,19.88) 70.98,18.98 70.82,18.83 v2(70.82,6.06)
DP_A_L0P: length 117.6
  Top Layer w0.165: U2.SG7 71.07,5.46 v2(71.1,5.48) ; C26.2 20.25,90.52 arc(20.42,90.55) 20.56,90.64 arc(20.84,90.83) 21.17,90.9 26.24,90.9 arc(27.08,90.73) v1(27.79,90.26) ; J1.255 16.74,91.12 arc(17.53,90.97) C26.1
  Inner2 w0.165: v1(27.79,90.26) 28,90.05 arc(28.06,89.95) 28.09,89.84 arc(28.11,89.73) 28.17,89.63 28.45,89.36 arc(29,88.53) 29.19,87.56 29.19,82.42 arc(29.36,81.57) 29.84,80.85 66.42,44.27 arc(66.97,43.45) 67.17,42.48 67.17,23.42 arc(67.3,22.75) 67.67,22.19 arc(68.24,21.82) 68.9,21.68 68.94,21.68 arc(69.74,21.53) 70.41,21.08 70.46,21.03 arc(70.47,21.02) 70.49,21.01 arc(70.5,21.01) 70.51,21 70.62,20.9 arc(71.17,20.07) 71.36,19.1 71.36,5.75 v2(71.1,5.48)
DP_A_L1N: length 118.2
  Top Layer w0.165: C25.2 28.72,91.79 arc(29.34,91.66) v1(29.86,91.31) ; v1(69.93,23.05) 70.08,22.9 arc(70.24,22.79) 70.43,22.76 arc(70.47,22.75) 70.5,22.73 70.71,22.52 arc(71.19,21.8) 71.36,20.95 71.36,8.71 arc(71.29,8.38) 71.1,8.09 arc(70.84,7.92) 70.53,7.86 U2.SC7 ; J1.259 16.44,92.12 arc(16.88,92.04) 17.26,91.79 arc(17.54,91.6) 17.87,91.53 20.64,91.53 arc(20.97,91.6) C25.1
  Inner2 w0.165: v1(69.93,23.05) 69.72,23.26 arc(69.66,23.36) 69.64,23.47 arc(69.61,23.58) 69.55,23.68 arc(69.46,23.81) 69.43,23.98 69.43,43.33 arc(69.26,44.18) 68.78,44.9 31.78,81.9 arc(31.23,82.72) 31.04,83.69 31.04,88.63 arc(30.98,88.76) 30.84,88.82 30.31,88.82 arc(30.12,89.01) 30.31,89.2 30.84,89.2 arc(30.98,89.25) 31.04,89.39 31.04,89.73 arc(30.92,90.34) 30.57,90.85 30.49,90.93 arc(30.39,91) 30.28,91.02 arc(30.17,91.04) 30.07,91.1 v1(29.86,91.31)
DP_A_L1P: length 118.2
  Top Layer w0.165: C24.2 20.25,92.42 arc(20.42,92.46) 20.56,92.55 arc(20.7,92.64) 20.86,92.68 23.93,92.68 arc(24.1,92.64) 24.24,92.55 arc(24.52,92.36) 24.85,92.3 29.09,92.3 arc(29.76,92.16) v1(30.33,91.78) ; v1(70.4,23.52) 70.55,23.37 arc(70.66,23.21) 70.7,23.02 arc(70.7,22.98) 70.72,22.95 70.93,22.74 arc(71.48,21.92) 71.68,20.95 71.68,8.3 arc(71.63,8.05) 71.48,7.84 71.21,7.57 arc(70.87,7.34) U2.SD7 ; J1.261 17.59,92.62 arc(17.86,92.57) 18.08,92.42
  Inner2 w0.165: v1(30.33,91.78) 30.54,91.57 arc(30.6,91.48) 30.63,91.36 arc(30.65,91.25) 30.71,91.16 30.8,91.07 arc(31.21,90.46) 31.35,89.73 31.35,83.69 arc(31.52,82.84) 32,82.12 69,45.12 arc(69.55,44.3) 69.74,43.33 69.74,23.98 arc(69.75,23.94) 69.78,23.9 69.8,23.87 arc(69.87,23.83) 69.94,23.82 69.98,23.82 arc(70.09,23.79) 70.19,23.73 v1(70.4,23.52)
DP_A_L2N: length 140.4
  Top Layer w0.165: U2.SJ2 79.09,4.26 arc(78.96,4.23) 78.85,4.16 78.72,4.03 arc(78.63,3.89) 78.6,3.72 78.6,2.79 arc(78.7,2.29) 78.98,1.87 arc(79.4,1.59) 79.9,1.49 81.36,1.49 arc(81.86,1.39) v1(82.28,1.11) ; v1(33.89,93.71) 28.25,93.71 arc(27.56,93.57) 26.97,93.18 ; J1.265 19.85,93.62 arc(20.1,93.58) 20.3,93.44 arc(20.44,93.34) 20.61,93.31 25.27,93.31 arc(25.43,93.28) 25.57,93.18
  Inner2 w0.165: v1(33.89,93.71) 34.19,93.71 arc(34.3,93.73) 34.4,93.8 arc(34.49,93.86) 34.6,93.88 35.51,93.88 arc(35.89,93.81) 36.21,93.59 37.62,92.18 arc(38.1,91.46) 38.27,90.61 38.27,80.64 arc(38.47,79.67) 39.02,78.85 78.77,39.09 arc(79.25,38.37) 79.42,37.52 79.42,7.44 arc(79.51,6.98) 79.77,6.6 arc(80.17,6) 80.31,5.29 80.31,2.48 arc(80.4,2.03) 80.66,1.65 80.68,1.63 arc(81,1.41) 81.39,1.33 81.48,1.33 arc(81.63,1.3) 81.75,1.22 arc(81.87,1.14) 82.02,1.11 v1(82.28,1.11)
DP_A_L2P: length 140.4
  Top Layer w0.165: J1.267 19.69,94.12 arc(20.09,94.05) 20.43,93.82 arc(20.57,93.73) 20.74,93.69 23,93.69 arc(23.97,93.89) 24.79,94.44 C22.1 ; U2.SK2 79.4,3.56 arc(79.33,3.51) 79.24,3.49 79.15,3.49 arc(78.98,3.42) 78.91,3.26 78.91,2.89 arc(79,2.48) 79.23,2.13 arc(79.51,1.94) 79.84,1.87 v1(82.53,1.87) ; v1(33.89,94.37) 28.58,94.37 arc(27.64,94.56) C22.2
  Inner2 w0.165: v1(33.89,94.37) 34.19,94.37 arc(34.3,94.35) 34.4,94.29 arc(34.49,94.22) 34.6,94.2 35.51,94.2 arc(36.01,94.1) 36.43,93.82 37.85,92.4 arc(38.4,91.58) 38.59,90.61 38.59,90.34 arc(38.65,90.21) 38.78,90.15 38.82,90.15 arc(39.01,89.96) 38.82,89.77 38.78,89.77 arc(38.65,89.71) 38.59,89.58 38.59,80.64 arc(38.76,79.79) 39.24,79.07 79,39.32 arc(79.55,38.49) 79.74,37.52 79.74,7.44 arc(79.81,7.11) 79.99,6.82 arc(80.46,6.12) 80.63,5.29 80.63,2.48 arc(80.69,2.15) 80.88,1.87 80.9,1.85 arc(81.13,1.7) 81.39,1.65 81.74,1.65 arc(81.88,1.68) 82,1.76 arc(82.13,1.84) 82.27,1.87 v1(82.53,1.87)
DP_A_L3N: length 132.6
  Top Layer w0.165: C21.2 22.94,94.45 arc(23.44,94.55) 23.86,94.84 24.7,95.67 arc(24.89,95.8) 25.13,95.85 33.94,95.85 arc(34.17,95.81) v1(34.36,95.68) ; v2(78.86,6.06) 79.46,6.06 ; 79.46,6.06 79.48,6.06 arc(79.49,6.06) U2.SF2 arc(79.48,6.06) 79.46,6.06 ; J1.271 16.12,95.12 arc(16.67,95.02) 17.13,94.71 arc(17.41,94.52) 17.74,94.45 C21.1
  Inner2 w0.165: v2(78.86,6.06) 78.86,6.81 arc(78.79,7.16) 78.6,7.46 arc(78.32,7.87) 78.23,8.35 78.23,11.37 78.35,11.49 78.53,11.49 78.65,11.6 78.65,11.75 78.53,11.87 78.35,11.87 78.23,11.98 78.23,37 arc(78.04,37.97) 77.49,38.8 33.53,82.75 arc(33.05,83.48) 32.88,84.33 32.88,91.41 arc(32.93,91.54) 33.07,91.6 33.37,91.6 arc(33.56,91.79) 33.37,91.98 33.07,91.98 arc(32.93,92.03) 32.88,92.17 32.88,95.22 arc(32.92,95.45) 33.06,95.65 33.13,95.72 arc(33.27,95.82) 33.44,95.85 33.77,95.85 arc(33.96,95.72) 34.18,95.68 v1(34.36,95.68)
DP_A_L3P: length 132.6
  Top Layer w0.165: v2(78.86,5.46) U2.SG2 ; J1.273 17.58,95.62 arc(17.71,95.65) C20.1 ; v1(34.36,96.34) 25.42,96.34 arc(24.78,96.21) 24.24,95.85 arc(23.82,95.57) 23.32,95.47 19.84,95.47 arc(19.51,95.54) C20.2
  Inner2 w0.165: v1(34.36,96.34) 34.18,96.34 arc(33.96,96.3) 33.77,96.17 33.44,96.17 arc(33.15,96.11) 32.91,95.95 32.83,95.87 arc(32.63,95.57) 32.56,95.22 32.56,84.33 arc(32.75,83.35) 33.3,82.53 77.26,38.57 arc(77.74,37.85) 77.91,37 77.91,9.02 arc(77.83,8.59) 77.58,8.22 77.47,8.11 arc(77.27,7.81) 77.2,7.46 77.2,7.11 arc(77.25,6.75) 77.4,6.41 77.48,6.34 arc(77.64,6.23) 77.83,6.19 arc(78.07,6.14) 78.27,6.01 78.79,5.48 arc(78.83,5.46) 78.86,5.46
FAN1_PWM: length 53.9
  Top Layer w0.165: U2.PK5 57.23,3.42 arc(57.59,3.34) 57.9,3.14 arc(57.99,3) 58.02,2.84 58.02,2.69 arc(57.99,2.52) 57.9,2.38 arc(57.61,2.19) 57.28,2.13 v1(57.26,2.13)
  Top Layer w0.254: v1(94.98,8.98) 97.13,8.98 arc(97.96,8.82) 98.66,8.35 arc(99.04,7.79) 99.17,7.12 99.17,6.02 arc(99.3,5.36) 99.68,4.79 arc(99.96,4.61) 100.28,4.54 101.05,4.54
  Inner3 w0.165: v1(57.26,2.13) 58.04,1.35 58.04,1.22 arc(58.86,0.67) 59.84,0.47 75.64,0.47 arc(76.61,0.67) 77.44,1.22 82.39,6.17 arc(82.59,6.47) 82.66,6.82 82.66,7.48 arc(82.73,7.81) 82.91,8.09 83.06,8.24 arc(83.88,8.79) 84.86,8.98 v1(94.98,8.98)
FAN1_SPEED: length 47
  Top Layer w0.165: 101.05,5.04 100.63,5.04 arc(100.46,5.08) 100.31,5.17 arc(100.13,5.45) 100.06,5.79 100.06,7.42 arc(99.87,8.4) 99.32,9.22 99.17,9.36 arc(98.89,9.55) 98.56,9.62 v1(94.34,9.62) ; U2.PJ2 62.39,4.02 arc(62.23,4.05) v1(62.09,4.14)
  Inner3 w0.165: v1(62.09,4.14) 62.15,4.2 arc(62.95,4.73) 63.9,4.92 65.54,4.92 arc(65.87,4.85) 66.15,4.67 66.42,4.39 arc(67.25,3.84) 68.22,3.65 71.96,3.65 arc(72.46,3.75) 72.88,4.03 arc(73.16,4.45) 73.26,4.95 73.26,5.94 arc(73.38,6.52) 73.71,7.02 73.77,7.08 arc(74.33,7.45) 75,7.59 76.33,7.59 arc(76.66,7.65) 76.95,7.84 arc(77.23,8.03) 77.56,8.09 82.05,8.09 arc(82.38,8.16) 82.66,8.35 82.83,8.51 arc(83.65,9.06) 84.62,9.26 89.21,9.26 arc(89.51,9.32) 89.77,9.49 arc(89.91,9.59) 90.08,9.62 v1(94.34,9.62)
FAN2_PWM: length 49.8
  Top Layer w0.165: v1(33.77,10.13) 27.45,10.13 arc(26.48,9.93) 25.66,9.38 21.57,5.3 arc(21.29,5.11) 20.95,5.04 FPC4.2 ; U2.PL5 arc(57.09,2.74) 57.05,2.68 56.63,2.25 arc(56.53,2.11) 56.5,1.95 56.5,1.87 arc(56.52,1.75) 56.59,1.65 56.63,1.62 arc(56.77,1.52) 56.93,1.49 57.18,1.49 arc(57.84,1.62) v1(58.4,2)
  Inner2 w0.165: v1(58.4,2) 58.05,2.35 arc(57.46,2.75) 56.75,2.89 52.03,2.89 arc(51.7,2.82) 51.42,2.63 arc(51.28,2.54) 51.11,2.51 50.76,2.51 arc(50.43,2.57) 50.15,2.76 arc(49.96,3.04) 49.89,3.37 49.89,7.3 arc(49.7,8.27) 49.15,9.09 49.11,9.13 arc(48.29,9.68) 47.32,9.87 34.38,9.87 arc(34.05,9.94) v1(33.77,10.13)
FAN2_SPEED: length 60.6
  Top Layer w0.165: FPC4.3 21.46,4.54 arc(21.8,4.48) 22.08,4.28 arc(22.27,4) 22.34,3.67 v1(22.34,3.4) ; U2.PH2 62.2,4.62 arc(62.09,4.63) 61.98,4.62 ; 61.98,4.62 arc(61.69,4.56) v2(61.45,4.4)
  Inner2 w0.165: v1(22.34,3.4) 22.34,3.12 arc(22.4,2.79) 22.59,2.51 23.62,1.47 arc(24.45,0.92) 25.42,0.73 27.38,0.73 arc(28.35,0.92) 29.18,1.47 30.1,2.4 arc(30.65,3.22) 30.84,4.19 30.84,7.21 arc(30.98,7.91) 31.38,8.51 31.62,8.75 arc(32.45,9.3) 33.42,9.49 47.19,9.49 arc(48.16,9.3) 48.99,8.75 49.01,8.73 arc(49.38,8.17) 49.51,7.5 49.51,2.92 arc(49.71,1.95) 50.26,1.13 50.28,1.11 arc(50.98,0.64) 51.81,0.47 59.37,0.47 arc(59.53,0.51) 59.67,0.6 60.83,1.76 arc(61.39,2.59) 61.58,3.56 61.45,3.69 v2(61.45,4.4)
PCIE_RX_0N: length 109.7
  Top Layer w0.165: J1.147 14.23,64.12 arc(14.29,64.14) 14.34,64.17 arc(14.39,64.2) 14.45,64.22 60.22,64.22 arc(61.07,64.05) 61.79,63.56 61.96,63.4 arc(62.05,63.26) v2(62.09,63.09) ; v2(63.23,62.83) 65.41,60.65 arc(65.96,59.83) 66.15,58.86 66.15,10.33 arc(66.26,9.79) 66.57,9.32 66.8,9.09 67.07,9.09 67.21,8.96 67.21,8.69 67.34,8.55 67.61,8.55 67.74,8.42 67.74,8.15 68.73,7.16 arc(68.78,7.13) 68.84,7.11 68.86,7.11 arc(68.94,7.13) 69,7.17 69.01,7.19 arc(69.09,7.24) 69.18,7.26 U2.SD8
  Bottom Layer w0.165: v2(63.23,62.83) 62.7,62.83 arc(62.37,62.9) v2(62.09,63.09)
PCIE_RX_0P: length 109.8
  Top Layer w0.165: J1.149 14.23,64.62 arc(14.29,64.61) 14.34,64.58 arc(14.39,64.54) 14.45,64.53 61.1,64.53 arc(61.5,64.45) 61.83,64.23 62.24,63.83 arc(62.5,63.43) 62.59,62.96 arc(62.66,62.61) 62.86,62.31 65.09,60.08 arc(65.64,59.26) 65.83,58.29 65.83,10.33 arc(65.97,9.66) 66.34,9.1 68.51,6.94 arc(68.66,6.83) 68.84,6.8 arc(68.93,6.78) 69.01,6.73 arc(69.09,6.67) 69.18,6.66 U2.SE8
PCIE_RX_1N: length 103.9
  Top Layer w0.165: J1.141 14.23,62.62 arc(14.29,62.64) 14.34,62.67 arc(14.39,62.7) 14.45,62.72 55.95,62.72 arc(56.8,62.55) 57.52,62.06 61.18,58.4 arc(61.66,57.68) 61.83,56.83 61.83,24.23 arc(61.91,23.66) v2(62.13,23.13) ; v2(67.67,16.73) 67.67,16.16 67.79,16.05 68.53,16.05 68.65,15.93 68.65,15.78 68.53,15.66 67.79,15.66 67.67,15.55 67.67,13.72 arc(67.87,12.75) 68.42,11.92 69.35,10.99 arc(69.61,10.6) 69.71,10.13 69.71,9.32 arc(69.68,9.17) U2.SA8
  Bottom Layer w0.165: v2(67.67,16.73) 62.74,21.66 arc(62.29,22.34) v2(62.13,23.13)
PCIE_RX_1P: length 103.9
  Top Layer w0.165: J1.143 14.23,63.12 arc(14.29,63.11) 14.34,63.08 arc(14.39,63.05) 14.45,63.03 55.95,63.03 arc(56.92,62.84) 57.74,62.29 61.41,58.63 arc(61.96,57.8) 62.15,56.83 62.15,24.79 arc(62.27,24.21) v2(62.59,23.72) ; U2.SB8 69.51,8.46 arc(68.65,8.63) 67.93,9.11 67.91,9.13 arc(67.36,9.95) 67.17,10.92 67.17,16.7 arc(67.27,17.2) v2(67.55,17.62)
  Bottom Layer w0.165: v2(67.55,17.62) 63.34,21.83 arc(62.79,22.65) 62.59,23.62 v2(62.59,23.72)
PCIE_RX_2N: length 107.1
  Top Layer w0.165: J1.135 14.23,61.12 arc(14.29,61.14) 14.34,61.17 arc(14.39,61.2) 14.45,61.22 55.29,61.22 arc(56.14,61.05) 56.86,60.56 59.15,58.28 arc(59.63,57.55) 59.8,56.7 59.8,22.52 59.68,22.4 59.65,22.4 59.53,22.28 59.53,22.14 59.65,22.02 59.68,22.02 59.8,21.9 59.8,21.75 59.68,21.64 59.65,21.64 59.53,21.52 59.53,21.37 59.65,21.26 59.68,21.26 59.8,21.14 59.8,20.99 59.68,20.88 59.65,20.88 59.53,20.76 59.53,20.61 59.65,20.5 59.68,20.5 59.8,20.38 59.8,20.23 59.68,20.11 59.65,20.11 59.53,20 59.53,19.85 59.65,19.73 59.68,19.73 59.8,19.62 59.8,19.47 59.68,19.35 59.65,19.35 59.53,19.24 59.53,19.09 59.65,18.97 59.68,18.97 59.8,18.85 59.8,17.46 arc(59.86,17.14) 60.04,16.87 60.11,16.8 arc(60.17,16.72) 60.19,16.63 arc(60.2,16.53) 60.26,16.45 v2(60.46,16.25) ; U2.SD6 71.83,7.26 arc(71.82,7.26) v2(71.82,7.26)
  Bottom Layer w0.165: v2(60.46,16.25) 60.67,16.04 arc(60.75,15.99) 60.84,15.97 arc(60.93,15.95) 61.01,15.9 69.45,7.46 arc(69.55,7.39) 69.67,7.37 71.78,7.37 arc(71.82,7.36) 71.85,7.34 arc(71.86,7.31) 71.85,7.28 v2(71.82,7.26)
PCIE_RX_2P: length 107.2
  Top Layer w0.165: J1.137 14.23,61.62 arc(14.29,61.61) 14.34,61.58 arc(14.39,61.55) 14.45,61.53 55.29,61.53 arc(56.26,61.34) 57.09,60.79 59.37,58.5 arc(59.92,57.68) 60.12,56.7 60.12,17.46 arc(60.16,17.26) 60.27,17.09 60.34,17.02 arc(60.42,16.97) 60.51,16.95 arc(60.6,16.93) 60.68,16.88 v2(60.89,16.67) ; U2.SE6 71.83,6.66 arc(71.82,6.66) v2(71.82,6.65)
  Bottom Layer w0.165: v2(60.89,16.67) 61.09,16.47 arc(61.15,16.39) 61.16,16.3 arc(61.18,16.2) 61.24,16.13 68.93,8.43 arc(69.75,7.88) 70.72,7.69 71.66,7.69 arc(71.83,7.72) 72,7.68 arc(72.23,7.47) 72.28,7.17 ; v2(71.82,6.65) 72,6.83 arc(72.15,6.94) 72.25,7.09 ; 72.28,7.17 arc(72.27,7.13) 72.25,7.09 ; 72.28,7.17 arc(72.27,7.13) 72.25,7.09
PCIE_RX_3N: length 108.8
  Top Layer w0.165: v2(70.34,58.64) 70.34,58.03 70.47,57.9 70.47,57.65 70.34,57.52 70.34,57.27 70.47,57.14 70.47,56.89 70.34,56.76 70.34,56.51 70.47,56.38 70.47,56.12 70.34,56 70.34,55.74 70.47,55.62 70.47,55.36 70.34,55.24 70.34,54.98 70.47,54.85 70.47,54.6 70.34,54.47 70.34,51.69 arc(70.53,50.72) 71.09,49.9 72.11,48.88 arc(72.66,48.05) 72.85,47.08 72.85,9.17 arc(72.86,9.11) U2.SA6 ; J1.121 14.23,57.62 arc(14.29,57.64) 14.34,57.67 arc(14.39,57.7) 14.45,57.72 arc(14.55,57.7) 14.63,57.64 14.78,57.49 arc(15.05,57.31) 15.38,57.24 21.18,57.24 arc(22.01,57.41) 22.72,57.88 arc(23,58.07) 23.33,58.13 40.24,58.13 arc(40.34,58.11) 40.42,58.06 arc(40.49,58.01) 40.59,57.99 v2(40.88,57.99)
  Bottom Layer w0.165: v2(40.88,57.99) 41.17,57.99 arc(41.26,58.01) 41.34,58.06 arc(41.42,58.11) 41.51,58.13 69.12,58.13 arc(69.78,58.26) v2(70.34,58.64)
PCIE_RX_3P: length 108.8
  Top Layer w0.165: v2(40.88,58.59) 40.59,58.59 arc(40.49,58.57) 40.42,58.52 arc(40.34,58.47) 40.24,58.45 23.33,58.45 arc(22.88,58.36) 22.49,58.1 arc(21.89,57.7) 21.18,57.56 15.38,57.56 arc(15.18,57.6) 15,57.72 14.85,57.87 arc(14.67,57.99) 14.45,58.03 arc(14.39,58.04) 14.34,58.08 arc(14.29,58.11) 14.23,58.12 J1.123 ; U2.SB6 72.8,8.56 arc(72.73,8.6) 72.64,8.62 72.55,8.62 arc(72.38,8.69) 72.31,8.86 72.31,9.35 arc(72.33,9.43) 72.37,9.49 arc(72.49,9.67) 72.53,9.88 72.53,46.76 arc(72.34,47.73) 71.79,48.56 69.82,50.53 arc(69.26,51.35) 69.07,52.33 v2(69.07,59.02)
  Bottom Layer w0.165: v2(40.88,58.59) 41.17,58.59 arc(41.26,58.57) 41.34,58.52 arc(41.42,58.47) 41.51,58.45 67.69,58.45 arc(68.44,58.6) v2(69.07,59.02)
PCIE_RX_4N: length 114
  Top Layer w0.165: 77.09,8.49 U2.SB3 arc(77.08,8.47) 77.11,8.48 77.45,8.48 77.51,8.53 arc(77.61,8.68) 77.64,8.86 77.64,13.22 arc(77.76,13.82) 78.11,14.33 79.82,16.05 arc(80.32,16.79) 80.49,17.66 80.49,50.22 arc(80.37,50.94) 80.04,51.58 76.44,55.18 arc(76.43,55.19) 76.43,55.21 arc(76.42,55.22) 76.42,55.23 75.8,55.85 arc(75.55,56.01) 75.26,56.07 v2(74.15,56.07) ; v2(43.04,56.07) 42.75,56.07 arc(42.65,56.09) 42.58,56.14 arc(42.5,56.2) 42.4,56.22 14.45,56.22 arc(14.39,56.2) 14.34,56.17 arc(14.29,56.14) 14.23,56.12 J1.115
  Bottom Layer w0.165: v2(74.15,56.07) 73.86,56.07 arc(73.77,56.09) 73.69,56.14 arc(73.61,56.2) 73.52,56.22 71.63,56.22 71.52,56.1 71.52,56.09 71.4,55.97 71.25,55.97 71.14,56.09 71.14,56.1 71.02,56.22 70.87,56.22 70.75,56.1 70.75,56.09 70.64,55.97 70.49,55.97 70.37,56.09 70.37,56.1 70.26,56.22 43.67,56.22 arc(43.58,56.2) 43.5,56.14 arc(43.42,56.09) 43.33,56.07 v2(43.04,56.07)
PCIE_RX_4P: length 114.2
  Top Layer w0.165: v2(43.04,56.68) 42.75,56.68 arc(42.65,56.66) 42.58,56.6 arc(42.5,56.55) 42.4,56.53 14.45,56.53 arc(14.39,56.54) 14.34,56.58 arc(14.29,56.61) 14.23,56.62 J1.117 ; v2(74.15,56.68) 73.9,56.68 arc(73.72,56.64) 73.58,56.54 73.52,56.48 arc(73.42,56.34) 73.39,56.18 73.39,55.9 arc(73.42,55.73) 73.52,55.59 arc(73.8,55.4) 74.13,55.34 75.03,55.34 arc(75.77,55.19) 76.4,54.77 79.8,51.37 arc(80.08,50.83) 80.17,50.22 80.17,17.66 arc(80.02,16.91) 79.6,16.27 77.88,14.56 arc(77.47,13.94) 77.33,13.22 77.33,9.7 arc(77.26,9.35) U2.SA3
  Bottom Layer w0.165: v2(74.15,56.68) 73.86,56.68 arc(73.77,56.66) 73.69,56.6 arc(73.61,56.55) 73.52,56.53 43.67,56.53 arc(43.58,56.55) 43.5,56.6 arc(43.42,56.66) 43.33,56.68 v2(43.04,56.68)
PCIE_RX_5N: length 113.8
  Top Layer w0.165: v2(77.45,50.13) 77.83,50.13 arc(78.12,50.07) 78.37,49.91 arc(78.84,49.2) 79.01,48.37 79.01,18.59 arc(78.84,17.72) 78.34,16.98 arc(77.92,16.7) 77.42,16.6 77,16.6 arc(76.83,16.57) 76.69,16.48 arc(76.6,16.34) 76.56,16.17 76.56,15.97 arc(76.61,15.73) 76.74,15.53 v2(76.82,15.46) ; J1.109 14.23,54.62 arc(14.29,54.64) 14.34,54.67 arc(14.39,54.7) 14.45,54.72 37.99,54.72 arc(38.18,54.68) v2(38.34,54.57) ; v2(78.15,6.74) 77.2,6.74 77.16,6.7 arc(77.11,6.69) U2.SE3
  Bottom Layer w0.165: v2(38.34,54.57) 38.63,54.57 arc(38.72,54.59) 38.8,54.64 38.81,54.66 arc(38.88,54.7) 38.95,54.72 38.97,54.72 arc(39.03,54.7) 39.08,54.67 42.62,51.13 arc(43.45,50.58) 44.42,50.39 76.84,50.39 arc(77.17,50.32) v2(77.45,50.13) ; v2(78.15,6.74) arc(77.94,6.78) 77.76,6.9 77.71,6.95 arc(77.59,7.1) 77.5,7.28 77.44,7.34 arc(76.88,8.17) 76.69,9.14 76.69,15.15 arc(76.72,15.32) v2(76.82,15.46)
PCIE_RX_5P: length 113.7
  Top Layer w0.165: v2(77.07,16.1) 77.19,16.1 arc(78.02,16.26) 78.72,16.73 arc(79.17,17.4) 79.33,18.19 79.33,18.96 79.45,19.09 79.45,19.34 79.33,19.47 79.33,19.72 79.45,19.85 79.45,20.1 79.33,20.23 79.33,20.48 79.45,20.61 79.45,20.86 79.33,20.99 79.33,21.24 79.45,21.37 79.45,21.62 79.33,21.75 79.33,22.01 79.45,22.13 79.45,22.39 79.33,22.51 79.33,22.77 79.45,22.9 79.45,23.15 79.33,23.28 79.33,48.37 arc(79.14,49.32) 78.6,50.13 78.32,50.41 arc(77.92,50.67) v2(77.45,50.77) ; J1.111 14.23,55.12 arc(14.29,55.11) 14.34,55.08 arc(14.39,55.05) 14.45,55.03 37.96,55.03 arc(38.06,55.05) 38.14,55.1 arc(38.21,55.16) 38.31,55.18 v2(38.34,55.18) ; U2.SD3 77.52,7.26 arc(77.76,7.25) v2(77.98,7.35)
  Bottom Layer w0.165: v2(38.34,55.18) 38.63,55.18 arc(38.72,55.16) 38.8,55.1 arc(38.88,55.05) 38.97,55.03 arc(39.15,55) 39.31,54.89 42.85,51.35 arc(43.57,50.87) 44.42,50.7 77.3,50.7 arc(77.38,50.72) v2(77.45,50.77) ; v2(77.98,7.35) arc(77.48,8.17) 77.33,9.12 77.33,15.73 arc(77.32,15.78) 77.3,15.83 ; 77.27,15.87 arc(77.17,15.99) v2(77.07,16.1) ; 77.27,15.87 arc(77.29,15.85) 77.3,15.83 ; 77.27,15.87 arc(77.29,15.85) 77.3,15.83
PCIE_RX_6N: length 121.8
  Top Layer w0.165: U2.SB1 80.77,8.46 arc(80.87,8.47) 80.94,8.53 arc(81.02,8.58) 81.11,8.6 81.19,8.6 arc(81.9,8.74) 82.5,9.14 arc(82.85,9.67) 82.98,10.28 82.98,49.37 arc(83.17,50.34) 83.72,51.17 85.73,53.17 arc(85.78,53.2) 85.84,53.22 85.86,53.22 arc(85.93,53.2) 86,53.16 86.01,53.14 arc(86.09,53.09) 86.18,53.07 v2(86.47,53.07) ; v2(43.04,53.07) 42.75,53.07 arc(42.65,53.09) 42.58,53.14 arc(42.5,53.2) 42.4,53.22 14.45,53.22 arc(14.39,53.2) 14.34,53.17 arc(14.29,53.14) 14.23,53.12 J1.103
  Bottom Layer w0.165: v2(86.47,53.07) 86.18,53.07 arc(86.09,53.09) 86.01,53.14 arc(85.93,53.2) 85.84,53.22 43.67,53.22 arc(43.58,53.2) 43.5,53.14 arc(43.42,53.09) 43.33,53.07 v2(43.04,53.07)
PCIE_RX_6P: length 121.8
  Top Layer w0.165: U2.SA1 80.77,9.06 arc(80.87,9.04) 80.94,8.99 arc(81.02,8.93) 81.11,8.91 81.19,8.91 arc(81.78,9.03) 82.28,9.36 arc(82.56,9.79) 82.66,10.28 82.66,49.5 arc(82.85,50.47) 83.4,51.3 85.5,53.39 arc(85.66,53.5) 85.84,53.53 arc(85.93,53.55) 86.01,53.6 arc(86.09,53.66) 86.18,53.68 v2(86.47,53.68) ; J1.105 14.23,53.62 arc(14.29,53.61) 14.34,53.58 arc(14.39,53.55) 14.45,53.53 42.4,53.53 arc(42.5,53.55) 42.58,53.6 arc(42.65,53.66) 42.75,53.68 v2(43.04,53.68)
  Bottom Layer w0.165: v2(86.47,53.68) 86.18,53.68 arc(86.09,53.66) 86.01,53.6 arc(85.93,53.55) 85.84,53.53 43.67,53.53 arc(43.58,53.55) 43.5,53.6 arc(43.42,53.66) 43.33,53.68 v2(43.04,53.68)
PCIE_RX_7N: length 126.8
  Top Layer w0.165: v2(45.32,51.57) 45.03,51.57 arc(44.94,51.59) 44.86,51.64 arc(44.78,51.7) 44.69,51.72 14.45,51.72 arc(14.39,51.7) 14.34,51.67 arc(14.29,51.64) 14.23,51.62 J1.97 ; U2.SD1 v1(81.14,7.26)
  Bottom Layer w0.165: v2(45.32,51.57) 45.61,51.57 arc(45.71,51.59) 45.78,51.64 arc(45.86,51.7) 45.96,51.72 86.06,51.72 arc(86.91,51.55) 87.63,51.06 90.07,48.62 arc(90.56,47.9) 90.72,47.05 90.72,31.5 arc(90.53,30.53) 89.98,29.71 88.92,28.64 88.73,28.64 88.55,28.47 88.55,28.28 88.38,28.1 88.19,28.1 88.01,27.93 88.01,27.74 87.84,27.56 87.65,27.56 87.47,27.39 87.47,27.2 87.3,27.03 87.11,27.03 86.94,26.85 86.94,26.66 86.76,26.49 86.57,26.49 86.4,26.31 86.4,26.12 86.22,25.95 86.03,25.95 85.86,25.77 85.86,25.59 85.68,25.41 85.5,25.41 85.32,25.23 85.32,25.05 85.14,24.87 84.96,24.87 84.78,24.69 84.78,24.51 84.6,24.33 84.42,24.33 84.24,24.15 84.24,23.97 84.07,23.79 83.88,23.79 83.7,23.62 83.7,23.43 83.53,23.25 83.34,23.25 83.16,23.08 83.16,22.89 82.99,22.71 82.8,22.71 82.63,22.54 82.63,22.35 82.45,22.18 82.26,22.18 82.09,22 82.09,21.81 81.91,21.64 81.72,21.64 81.55,21.46 81.55,21.27 81.37,21.1 81.19,21.1 81.01,20.92 81.01,20.74 80.67,20.4 arc(80.12,19.58) 79.93,18.6 79.93,10.28 arc(80.05,9.67) 80.4,9.14 80.57,8.97 arc(80.69,8.79) 80.74,8.57 80.74,8.22 arc(80.84,7.7) v1(81.14,7.26)
PCIE_RX_7P: length 126.8
  Top Layer w0.165: J1.99 14.23,52.12 arc(14.29,52.11) 14.34,52.08 arc(14.39,52.05) 14.45,52.03 44.69,52.03 arc(44.78,52.05) 44.86,52.1 arc(44.94,52.16) 45.03,52.18 v2(45.32,52.18) ; U2.SE1 81.11,6.66 arc(81.33,6.7) 81.52,6.82 81.59,6.9 arc(81.79,7.16) v1(81.9,7.46)
  Bottom Layer w0.165: v2(45.32,52.18) 45.61,52.18 arc(45.71,52.16) 45.78,52.1 arc(45.86,52.05) 45.96,52.03 86.06,52.03 arc(87.03,51.84) 87.85,51.29 90.3,48.84 arc(90.85,48.02) 91.04,47.05 91.04,31.37 arc(90.85,30.4) 90.3,29.58 80.99,20.27 arc(80.44,19.44) 80.25,18.47 80.25,10.28 arc(80.35,9.79) 80.63,9.36 81.45,8.54 arc(81.78,8.05) v1(81.9,7.46)
PCIE_TX_0N: length 127
  Top Layer w0.165: U2.SG8 69.18,5.46 arc(69.09,5.44) 69.01,5.38 arc(68.93,5.33) 68.84,5.31 arc(68.34,5.41) 67.91,5.7 ; 67.92,5.71 66.87,6.75 66.87,6.92 67.15,7.2 67.15,7.36 67.05,7.47 66.88,7.47 66.6,7.19 66.44,7.19 66.33,7.29 66.33,7.46 66.61,7.74 66.61,7.9 66.51,8.01 66.34,8.01 66.06,7.73 65.9,7.73 65.63,8 arc(65.26,8.65) 65.13,9.4 65.13,57.72 arc(64.94,58.69) 64.39,59.51 63.67,60.23 63.67,60.55 63.56,60.66 63.24,60.66 63.13,60.77 63.13,61.09 63.02,61.2 62.7,61.2 62.59,61.31 62.59,61.63 62.48,61.74 62.16,61.74 61.53,62.37 arc(60.74,62.9) 59.8,63.09 arc(59.64,63.19) 59.46,63.23 v2(59.27,63.23) ; v2(0.91,64.4) 1.61,64.4 arc(1.88,64.46) C2.2
  Bottom Layer w0.165: v2(0.91,64.4) 1.12,64.61 arc(1.17,64.69) 1.19,64.78 arc(1.21,64.87) 1.26,64.95 1.3,64.99 arc(1.35,65.02) 1.4,65.03 57.94,65.03 arc(58.33,64.96) 58.66,64.74 arc(59.11,64.06) 59.27,63.26 v2(59.27,63.23)
